# Altium project RNG_RPI.PrjPcb (part 3 of 3)

## Sheet GPS_SATA.SchDoc: RNG RPI Interface
size 420 x 297 mm; Author: G.Kasprowicz; CompanyName: WUT ISE; DrawnBy: G.Kasprowicz; Organization: WUT ISE; Address1: PW ISE; Address2: Nowowiejska 15/19 00-665 Warsaw; Address3: gkasprow@gmail.com; Revision: 2; SheetNumber: -; SheetTotal: -; ModifiedBy: -; CheckedDate: -; Title2: GPS & SATA IO; DivGrp: WUT ISE; Designer: G.Kasprowicz; ModifiedDate: -; ProjectName: Sensor Box
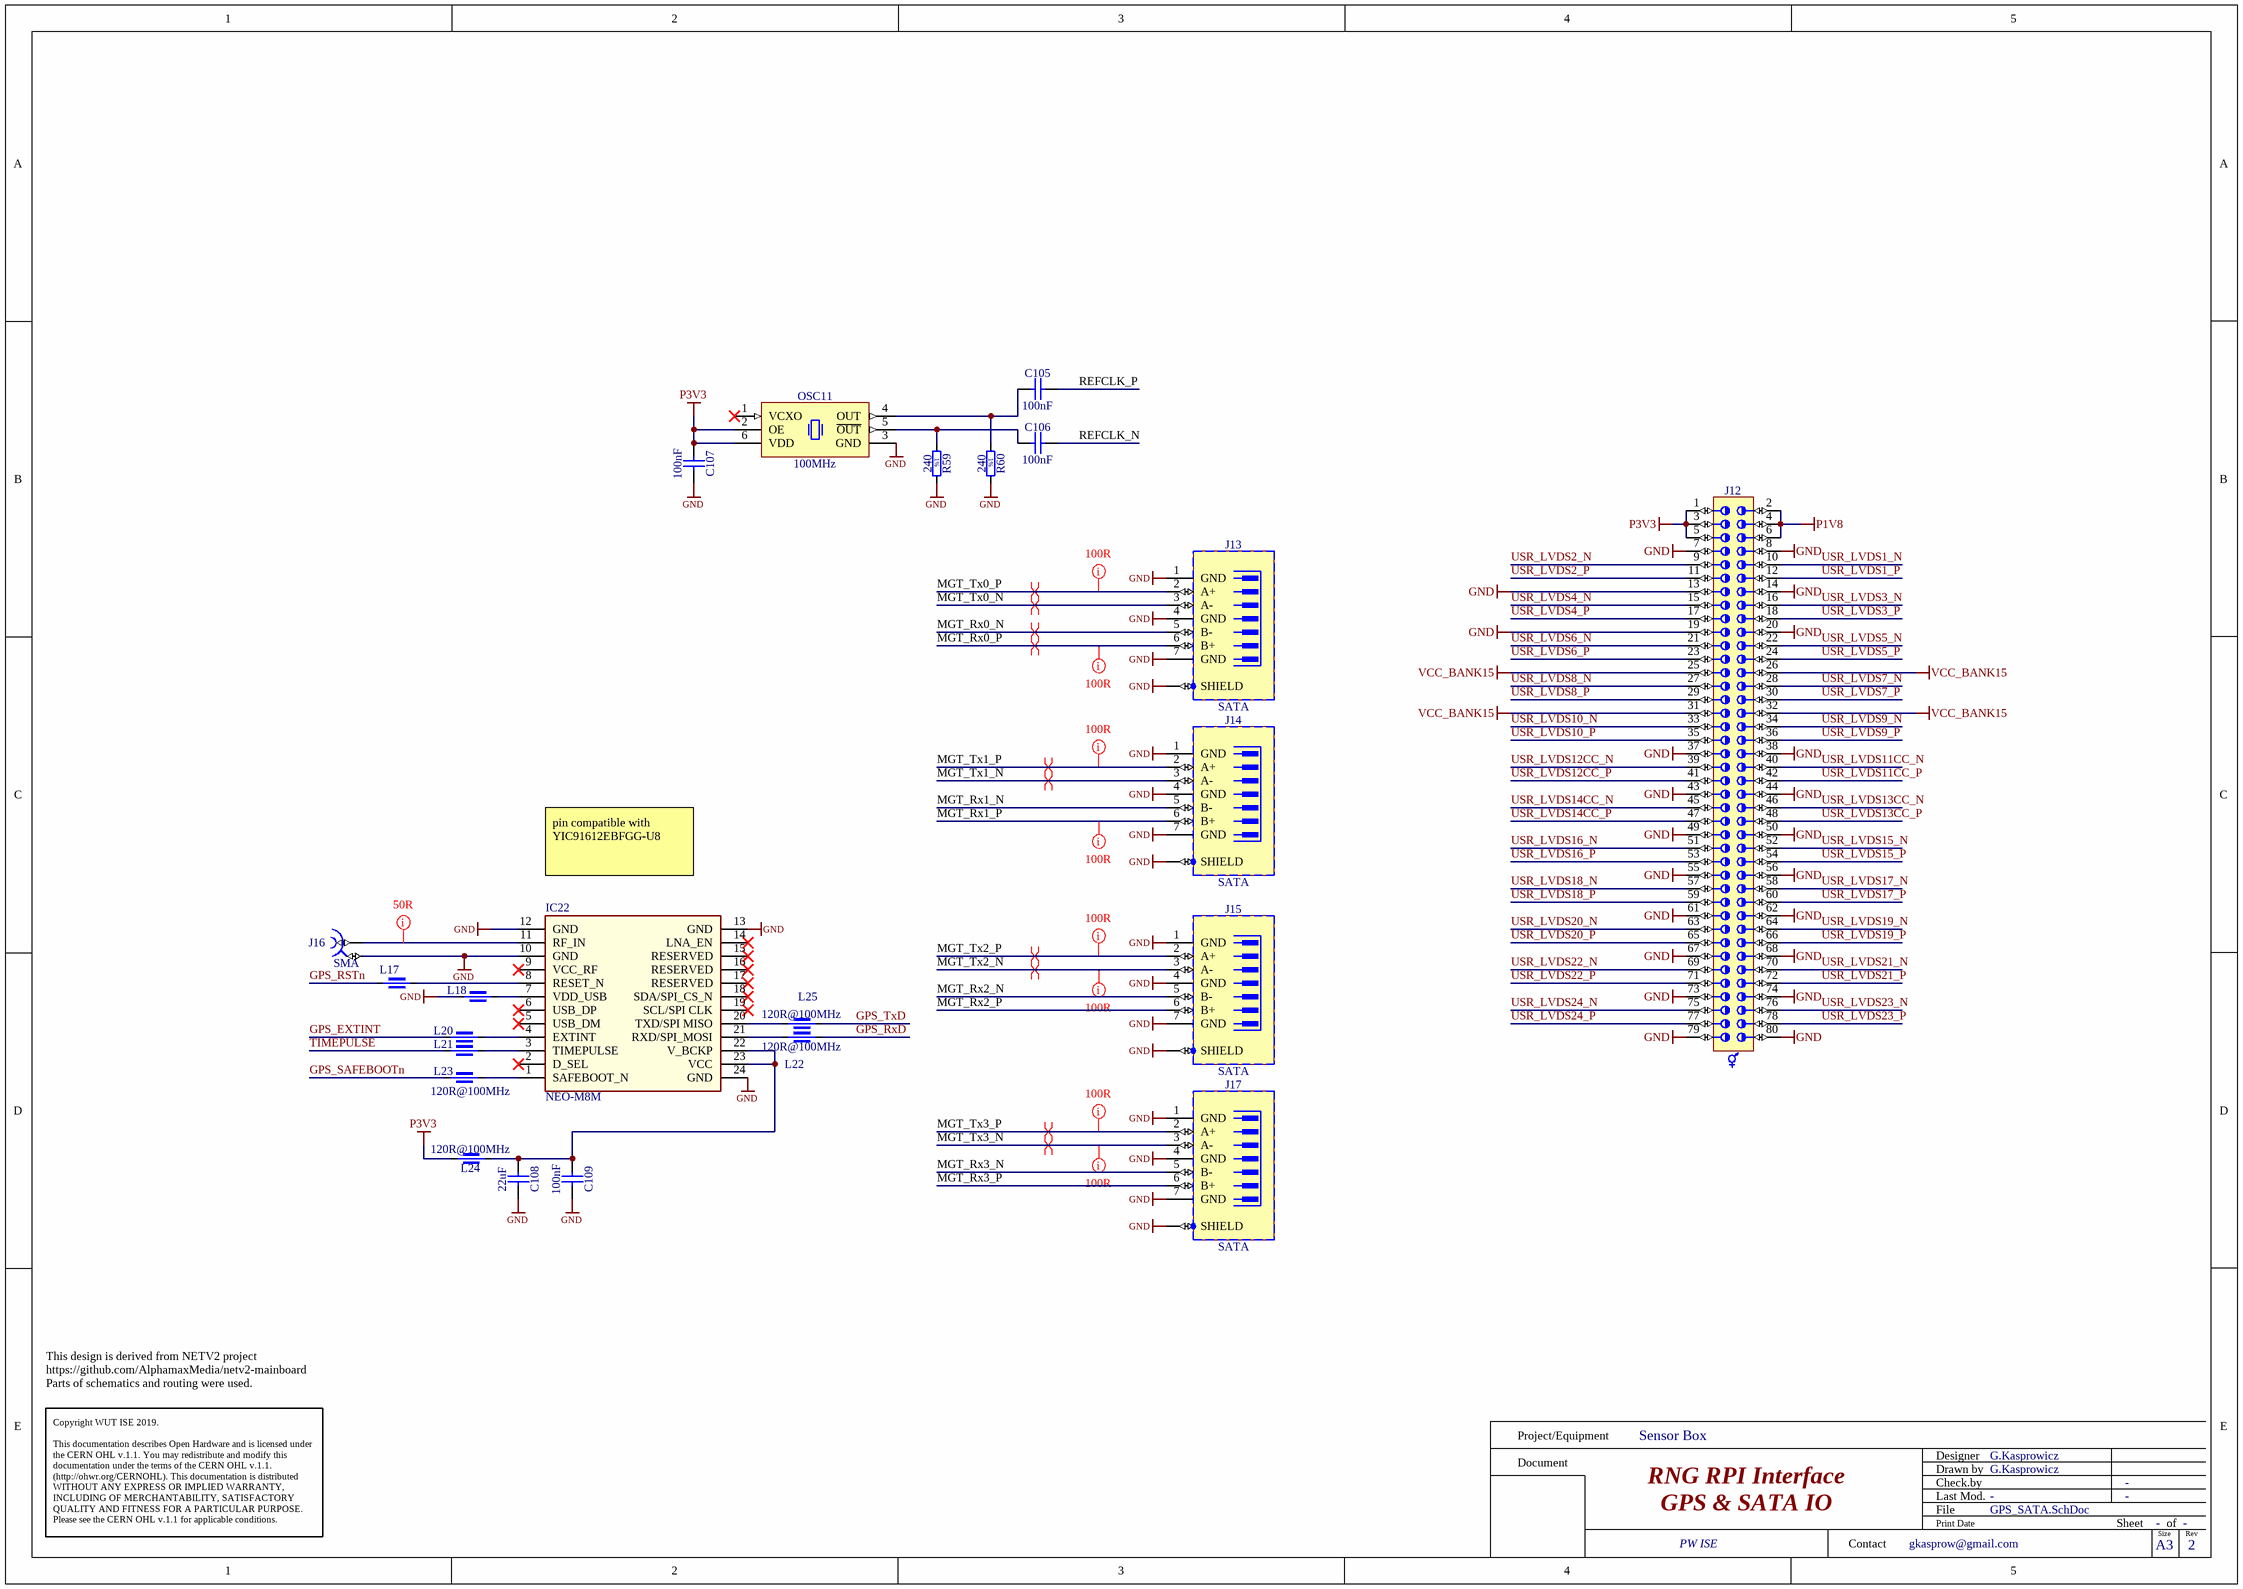
[diagram p4: GPS_SATA.SchDoc]

### Parts
C105  100nF  [CAPC0603X33N]
C106  100nF  [CAPC0603X33N]
C107  100nF  [CAPC0603X33N]
C108  22uF  [CAPC2012X135N]
C109  100nF  [CAPC0603X33N]
IC22  NEO-M8M  [NEO]
J12  (no value)  [SAMTEC_LSS-140-01-L-DV-A]
J13  SATA  [3M_5607-4200-SH]
J14  SATA  [3M_5607-4200-SH]
J15  SATA  [3M_5607-4200-SH]
J16  SMA  [MOLEX_73251-2120]
J17  SATA  [3M_5607-4200-SH]
L17  120R@100MHz  [INDC1608X65N]  (value not drawn)
L18  120R@100MHz  [INDC1608X65N]  (value not drawn)
L20  120R@100MHz  [INDC1608X65N]  (value not drawn)
L21  120R@100MHz  [INDC1608X65N]  (value not drawn)
L22  120R@100MHz  [INDC1608X65N]
L23  120R@100MHz  [INDC1608X65N]
L24  120R@100MHz  [INDC1608X65N]
L25  120R@100MHz  [INDC1608X65N]
OSC11  100MHz  [OSCSC254P500X700X190-6N]
R59  240  [RESC1005X40N]
R60  240  [RESC1005X40N]

### Nets
GND: C107.2 C108.2 C109.2 IC22.10(GND) IC22.12(GND) IC22.13(GND) IC22.24(GND) J12.7 J12.8 J12.13 J12.14 J12.19 J12.20 J12.37 J12.38 J12.43 J12.44 J12.49 J12.50 J12.55 J12.56 J12.61 J12.62 J12.67 J12.68 J12.73 J12.74 J12.79 J12.80 J13.1(GND) J13.4(GND) J13.7(GND) J13.8(SHIELD) J14.1(GND) J14.4(GND) J14.7(GND) J14.8(SHIELD) J15.1(GND) J15.4(GND) J15.7(GND) J15.8(SHIELD) J16.2 J17.1(GND) J17.4(GND) J17.7(GND) J17.8(SHIELD) L18.2 OSC11.3(GND) R59.2 R60.2
P1V8: J12.2 J12.4 J12.6
P3V3: C107.1 J12.1 J12.3 J12.5 L24.2 OSC11.2(OE) OSC11.6(VDD)
VCC_BANK15: J12.25 J12.26 J12.31 J12.32
GPS_EXTINT: L20.2
GPS_RSTn: L17.1
GPS_RxD: L22.2
GPS_SAFEBOOTn: L23.2
GPS_TxD: L25.1
MGT_Rx0_N: J13.5(B-)
MGT_Rx0_P: J13.6(B+)
MGT_Rx1_N: J14.5(B-)
MGT_Rx1_P: J14.6(B+)
MGT_Rx2_N: J15.5(B-)
MGT_Rx2_P: J15.6(B+)
MGT_Rx3_N: J17.5(B-)
MGT_Rx3_P: J17.6(B+)
MGT_Tx0_N: J13.3(A-)
MGT_Tx0_P: J13.2(A+)
MGT_Tx1_N: J14.3(A-)
MGT_Tx1_P: J14.2(A+)
MGT_Tx2_N: J15.3(A-)
MGT_Tx2_P: J15.2(A+)
MGT_Tx3_N: J17.3(A-)
MGT_Tx3_P: J17.2(A+)
REFCLK_N: C106.2
REFCLK_P: C105.2
TIMEPULSE: L21.2
USR_LVDS1_N: J12.10
USR_LVDS1_P: J12.12
USR_LVDS2_N: J12.9
USR_LVDS2_P: J12.11
USR_LVDS3_N: J12.16
USR_LVDS3_P: J12.18
USR_LVDS4_N: J12.15
USR_LVDS4_P: J12.17
USR_LVDS5_N: J12.22
USR_LVDS5_P: J12.24
USR_LVDS6_N: J12.21
USR_LVDS6_P: J12.23
USR_LVDS7_N: J12.28
USR_LVDS7_P: J12.30
USR_LVDS8_N: J12.27
USR_LVDS8_P: J12.29
USR_LVDS9_N: J12.34
USR_LVDS9_P: J12.36
USR_LVDS10_N: J12.33
USR_LVDS10_P: J12.35
USR_LVDS11CC_N: J12.40
USR_LVDS11CC_P: J12.42
USR_LVDS12CC_N: J12.39
USR_LVDS12CC_P: J12.41
USR_LVDS13CC_N: J12.46
USR_LVDS13CC_P: J12.48
USR_LVDS14CC_N: J12.45
USR_LVDS14CC_P: J12.47
USR_LVDS15_N: J12.52
USR_LVDS15_P: J12.54
USR_LVDS16_N: J12.51
USR_LVDS16_P: J12.53
USR_LVDS17_N: J12.58
USR_LVDS17_P: J12.60
USR_LVDS18_N: J12.57
USR_LVDS18_P: J12.59
USR_LVDS19_N: J12.64
USR_LVDS19_P: J12.66
USR_LVDS20_N: J12.63
USR_LVDS20_P: J12.65
USR_LVDS21_N: J12.70
USR_LVDS21_P: J12.72
USR_LVDS22_N: J12.69
USR_LVDS22_P: J12.71
USR_LVDS23_N: J12.76
USR_LVDS23_P: J12.78
USR_LVDS24_N: J12.75
USR_LVDS24_P: J12.77
NetC105_1: C105.1 OSC11.4(OUT) R60.1
NetC106_1: C106.1 OSC11.5(~{OUT}) R59.1
NetC108_1: C108.1 C109.1 IC22.22(V_BCKP) IC22.23(VCC) L24.1
NetIC22_1: IC22.1(SAFEBOOT_N) L23.1
NetIC22_3: IC22.3(TIMEPULSE) L21.1
NetIC22_4: IC22.4(EXTINT) L20.1
NetIC22_7: IC22.7(VDD_USB) L18.1
NetIC22_8: IC22.8(RESET_N) L17.2
NetIC22_11: IC22.11(RF_IN) J16.1
NetIC22_20: IC22.20(TXD/SPI_MISO) L25.2
NetIC22_21: IC22.21(RXD/SPI_MOSI) L22.1

Not connected (* = marked no-connect by the designer): IC22 2(D_SEL)* 5(USB_DM)* 6(USB_DP)* 9(VCC_RF)* 14(LNA_EN)* 15(RESERVED)* 16(RESERVED)* 17(RESERVED)* 18(SDA/SPI_CS_N)* 19(SCL/SPI_CLK)*; OSC11 1(VCXO)*

### Layout directives
differential pair: MGT_Rx0_N, MGT_Rx0_P, MGT_Tx0_N, MGT_Tx0_P, MGT_Tx1_N, MGT_Tx1_P, MGT_Tx2_N, MGT_Tx2_P, MGT_Tx3_N, MGT_Tx3_P
net class Z100R: MGT_Rx0_P, MGT_Rx1_P, MGT_Tx0_P, MGT_Tx1_P, MGT_Tx2_N, MGT_Tx2_P, MGT_Tx3_N, MGT_Tx3_P
net class Z50R: NetIC22_11

### Notes on the sheet
- pin compatible with YIC91612EBFGG-U8
- This design is derived from NETV2 project
  https://github.com/AlphamaxMedia/netv2-mainboard
  Parts of schematics and routing were used.
- Project/Equipment
- Document
- Designer
- Drawn by
- Check.by
- Copyright WUT ISE 2019.
  This documentation describes Open Hardware and is licensed under the CERN OHL v.1.1. You may redistribute and modify this documentation under the terms of the CERN OHL v.1.1. (http://ohwr.org/CERNOHL). This documentation is distributed WITHOUT ANY EXPRESS OR IMPLIED WARRANTY, INCLUDING OF MERCHANTABILITY, SATISFACTORY QUALITY AND FITNESS FOR A PARTICULAR PURPOSE. Please see the CERN OHL v.1.1 for applicable conditions.
- Contact
- File
- Last Mod.
- Print Date
- Sheet
- Size
- A3
- of
- Rev
- (in symbol R0402_240R_1%_0.0625W_100PPM) 1%

### Library data of the parts
C105-C107 C109 = CC0201_100NF_6.3V_10%_X5R: Non-polarised capacitor; Part Description: SMD Multilayer Chip Ceramic Capacitor; Manufacturer: GENERIC; Manufacturer1 Part Number: 02016D104KAT2A; Voltage: 6.3V; TC: X5R; Tolerance: ±10%; Part Number: CC0201_100NF_6.3V_10%_X5R; Component Kind: Standard; Component Type: Standard; Pin Count: 2; Value: 100nF; Status: Not Recommended; Manufacturer Part Number: CC0201_100NF_6.3V_10%_X5R; Case: 0201; Mounted: Yes; Socket: No; SMD: Yes; Sense: No; Manufacturer1 Example: AVX; Manufacturer1 ComponentHeight: 0.33mm; HelpURL: \\cern.ch\dfs\Applications\Altium\Datasheets\CC0201_X5R_AVX.pdf; Author: CERN DEM JLC; CreateDate: 03.12.2007; LatestRevisionDate: 03.12.2007
C108 = CC0805_22UF_16V_10%_X5R: Non-polarised capacitor; Part Description: SMD Multilayer Chip Ceramic Capacitor; Manufacturer: GENERIC; Manufacturer1 Part Number: C2012X5R1C226KT; Voltage: 16V; TC: X5R; Tolerance: ±10%; LatestRevisionDate: 25.10.2012; Value: 22uF; Part Number: CC0805_22UF_16V_10%_X5R; Component Kind: Standard; Component Type: Standard; Pin Count: 2; Status: Preferred; Manufacturer Part Number: CC0805_22UF_16V_10%_X5R; Case: 0805; Mounted: Yes; Socket: No; SMD: Yes; Sense: No; Manufacturer1 Example: TDK; Manufacturer1 ComponentHeight: 1.35mm; HelpURL: \\cern.ch\dfs\Applications\Altium\Datasheets\CC0805_X5R_TDK_C.pdf; Author: CERN DEM JLC; CreateDate: 25.10.2012
IC22 = NEO: u-blox NEO GNSS module; Part Description: u-blox GNSS module; Manufacturer: u-blox; Value: NEO-M8M
J12 = SAMTEC_LSS-140-01-L-DV-A: Connector 80 Hermaphroditic; Part Description: 80 Contacts, Pitch 0.635mm, Razor Beam LSS Vertical High Speed Hermaphroditic Strip (Lead Style 4.5mm); Manufacturer: SAMTEC; PressFit: No; Part Number: SAMTEC_LSS-140-01-L-DV-A; Component Kind: Standard; Component Type: Standard; Pin Count: 80; Mounted: Yes; Socket: No; Sense: No; SMD: Yes; Status: None; Manufacturer Part Number: LSS-140-01-L-DV-A; ComponentHeight: 4.57mm; HelpURL: \\cern.ch\dfs\Applications\Altium\Datasheets\SAMTEC_LSS-140-01-L-DV-A.pdf; Author: CERN DEM JMW; CreateDate: 10.11.2015; LatestRevisionDate: 10.11.2015
J13-J15 J17 = 3M_5607-4200-SH: 7 Pin + 1 Shield SATA Receptacle; Part Description: Signal Plug, Surfacemount, Right Angle,  Serial Advanced Technology Attachment (SATA) Connector, 5607 Series; Manufacturer: 3M; PressFit: No; Part Number: 3M_5607-4200-SH; Component Kind: Standard; Component Type: Standard; Pin Count: 8; Family: SATA; Mounted: Yes; Socket: No; SMD: Yes; Sense: No; Status: None; Manufacturer Part Number: 5607-4200-SH; ComponentHeight: 4mm; HelpURL: \\cern.ch\dfs\Applications\Altium\Datasheets\3M_5607-4200-SH.pdf; Author: CERN DEM JLC; CreateDate: 14.02.2011; LatestRevisionDate: 31.05.2011
J16 = CON_SMA_RA_SMD_73251-2120: 50 Ohm, SMA Edge Mount PCB, With Jam Nut And Lock Washer; Manufacturer: MOLEX; PressFit: No; Part Number: MOLEX_73251-2120; Component Kind: Standard; Component Type: Standard; Pin Count: 5; Family: SMA; Mounted: Yes; Socket: No; SMD: Yes; Sense: No; Status: None; Part Description: 50 Ohm, SMA Edge Mount PCB, With Jam Nut And Lock Washer; Manufacturer Part Number: 73251-2120; ComponentHeight: 5.75mm; HelpURL: \\cern.ch\dfs\Applications\Altium\Datasheets\MOLEX_73251-2121.pdf; Author: CERN DEM JLC; CreateDate: 26.10.2016; LatestRevisionDate: 26.10.2016
L17 L18 L20-L25 = IND0603_MURATA_BLM18SG121TN1D: Part Description: SMD EMIFIL Suppression Chip Ferrite Bead; Manufacturer: MURATA; Power: 3A; Resistance: 0.025R; Tolerance: ±25%; LatestRevisionDate: 25.10.2018; Value: 120R@100MHz; Part Number: IND0603_MURATA_BLM18SG121TN1D; Component Kind: Standard; Component Type: Standard; Pin Count: 2; Status: None; Manufacturer Part Number: BLM18SG121TN1D; Case: 0603; Mounted: Yes; Socket: No; SMD: Yes; Sense: No; ComponentHeight: 0.65mm; HelpURL: \\cern.ch\dfs\Applications\Altium\Datasheets\IND0603_MURATA_BLM18S.pdf; Author: CERN DEM JLC; CreateDate: 23.07.2014
OSC11 = OSC_100MHz_LVPECL: VCXO 100MHz Oscillator; Part Number: OSC_100MHZ_ABRACON_ASG-P-V-A-100.000MHZ; Part Description: Stability: ± 50ppm, -40°C to +85°C, Programmable - High Performance SMD XO, LVPECL Output, ASG-P Series; Manufacturer: ABRACON; Manufacturer Part Number: ASG-P-V-A-100.000MHZ; PressFit: No; Bonding: No; Component Kind: Standard; Component Type: Standard; PackageDescription: Oscillator, side concave; 2.54mm pitch; 6 pin, 5.00mm L X 7.00mm W X 1.90mm H, IPC Medium Density; Value: 100MHz; Pin Count: 6; Mounted: Yes; Socket: No; SMD: Yes; Sense: No; ComponentHeight: 1.9mm; HelpURL: \\cern.ch\dfs\Applications\Altium\Datasheets\OSC_ABRACON_ASG-D.pdf; Author: GK; CreateDate: 20.04.2016; LatestRevisionDate: 20.04.2016
R59 R60 = R0402_240R_1%_0.0625W_100PPM: Resistor - 1%; Part Description: General Purpose Thick Film Chip Resistor; Manufacturer: GENERIC; Manufacturer1 Part Number: 232270672401L; TC: ±100ppm/°C; PressFit: No; Part Number: R0402_240R_1%_0.0625W_100PPM; Component Kind: Standard; Component Type: Standard; Pin Count: 2; Value: 240; Status: Not Recommended; Power: 0.0625W; Tolerance: ±1%; Manufacturer Part Number: R0402_240R_1%_0.0625W_100PPM; Case: 0402; Mounted: Yes; Sense: No; Socket: No; SMD: Yes; Manufacturer1 Example: YAGEO PHYCOMP; Manufacturer1 ComponentHeight: 0.4mm; HelpURL: \\cern.ch\dfs\Applications\Altium\Datasheets\R0402_Phycomp_RC0402.pdf; Author: CERN DEM JLC; CreateDate: 03.12.2007; LatestRevisionDate: 17.10.2012

## Sheet Ethernet_SD.SchDoc: RNG RPI Interface
size 420 x 297 mm; Author: G.Kasprowicz; CompanyName: WUT ISE; DrawnBy: G.Kasprowicz; Organization: WUT ISE; Address1: PW ISE; Address2: Nowowiejska 15/19 00-665 Warsaw; Address3: gkasprow@gmail.com; Revision: 2; SheetNumber: -; SheetTotal: -; ModifiedBy: -; CheckedDate: -; Title2: Interfaces; DivGrp: WUT ISE; Designer: G.Kasprowicz; ModifiedDate: -; ProjectName: Sensor Box
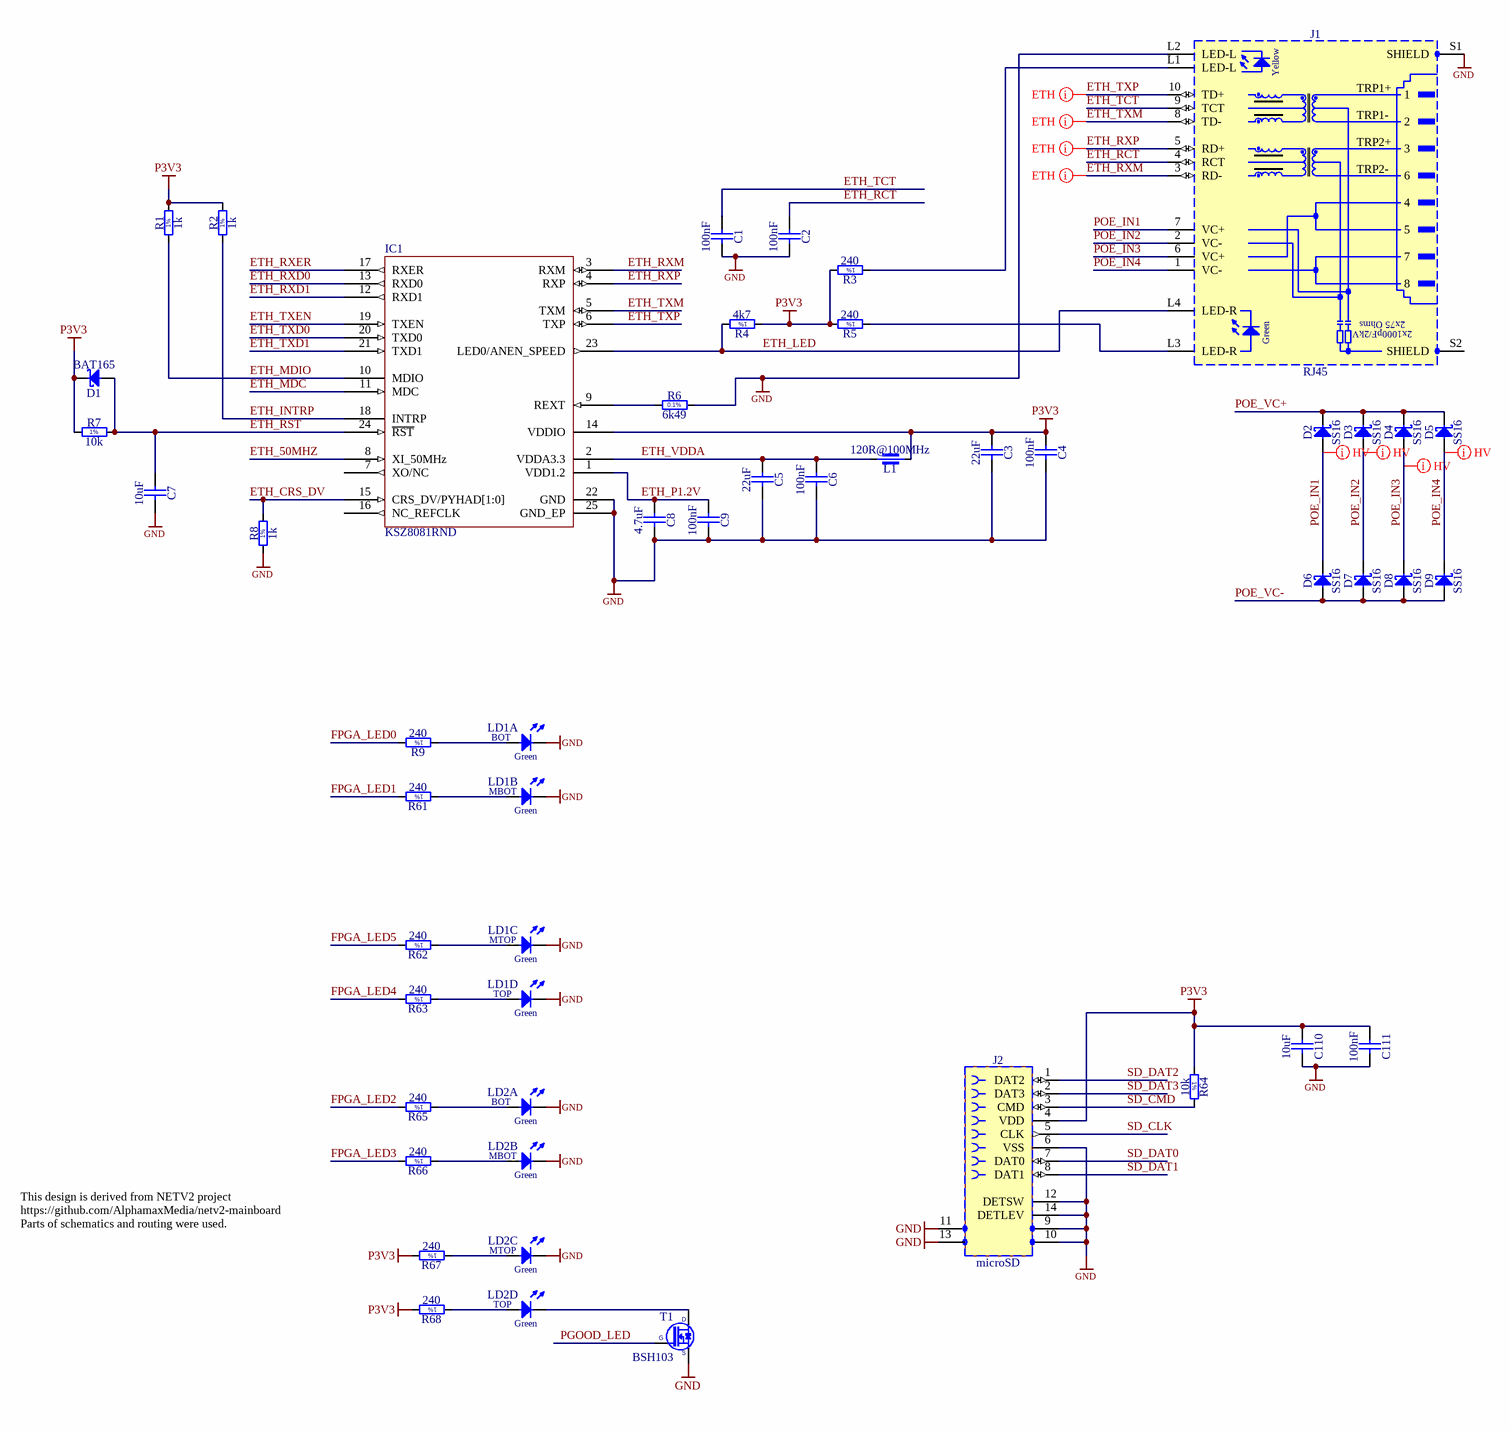
[diagram p5: Ethernet_SD.SchDoc]

### Parts
C1  100nF  [CAPC2012X135N]
C2  100nF  [CAPC2012X135N]
C3  22uF  [CAPC2012X135N]
C4  100nF  [CAPC0603X33N]
C5  22uF  [CAPC2012X135N]
C6  100nF  [CAPC0603X33N]
C7  10uF  [CAPC1608X80N]
C8  4.7uF  [CAPC1005X55N]
C9  100nF  [CAPC0603X33N]
C110  10uF  [CAPC1608X80N]
C111  100nF  [CAPC0603X33N]
D1  BAT165  [SOD2512X110N]
D2  SS16  [DIOM5127X229N]
D3  SS16  [DIOM5127X229N]
D4  SS16  [DIOM5127X229N]
D5  SS16  [DIOM5127X229N]
D6  SS16  [DIOM5127X229N]
D7  SS16  [DIOM5127X229N]
D8  SS16  [DIOM5127X229N]
D9  SS16  [DIOM5127X229N]
IC1  KSZ8081RND  [QFN50P400X400-24VBN]
J1  RJ45  [ABRACON_ARJM11C7-114-BA-EW2]
J2  microSD  [MOLEX_502570-0893]
L1  120R@100MHz  [INDC1608X65N]
LD1  Green  [LED_BIVAR_H485CGDL]  (value not drawn)  (parts A,B,C,D of 4)
LD2  Green  [LED_BIVAR_H485CGDL]  (value not drawn)  (parts A,B,C,D of 4)
R1  1k  [RESC1005X40N]
R2  1k  [RESC1005X40N]
R3  240  [RESC1005X40N]
R4  4k7  [RESC1005X40N]
R5  240  [RESC1005X40N]
R6  6k49  [RESC1005X35N]
R7  10k  [RESC1005X40N]
R8  1k  [RESC1005X40N]
R9  240  [RESC1005X40N]
R61  240  [RESC1005X40N]
R62  240  [RESC1005X40N]
R63  240  [RESC1005X40N]
R64  10k  [RESC1005X40N]
R65  240  [RESC1005X40N]
R66  240  [RESC1005X40N]
R67  240  [RESC1005X40N]
R68  240  [RESC1005X40N]
T1  BSH103  [SOT95P230X110-3N]

### Nets
GND: C1.2 C2.2 C3.2 C4.2 C5.2 C6.2 C7.2 C8.2 C9.2 C110.2 C111.2 IC1.22(GND) IC1.25(GND_EP) J1.L2(LED-L) J1.S1(SHIELD) J2.6(VSS) J2.9 J2.10 J2.11 J2.12(DETSW) J2.13 J2.14(DETLEV) LD1.1(C) LD1.3(C) LD1.5(C) LD1.7(C) LD2.1(C) LD2.3(C) LD2.5(C) R6.2 R8.1 T1.2(S)
P3V3: C3.1 C4.1 C110.1 C111.1 D1.1(C) IC1.14(VDDIO) J2.4(VDD) L1.1 R1.2 R2.2 R3.2 R4.1 R5.2 R7.1 R64.1 R67.2 R68.2
ETH_50MHZ: IC1.8(XI_50MHz)
ETH_CRS_DV: IC1.15(CRS_DV/PYHAD[1:0]) R8.2
ETH_INTRP: IC1.18(INTRP) R2.1
ETH_LED: IC1.23(LED0/ANEN_SPEED) J1.L4(LED-R) R4.2
ETH_MDC: IC1.11(MDC)
ETH_MDIO: IC1.10(MDIO) R1.1
ETH_P1.2V: C8.1 C9.1 IC1.1(VDD1.2)
ETH_RCT: C2.1 J1.4(RCT)
ETH_RST: C7.1 D1.2(A) IC1.24(~{RST}) R7.2
ETH_RXD0: IC1.13(RXD0)
ETH_RXD1: IC1.12(RXD1)
ETH_RXER: IC1.17(RXER)
ETH_RXM: IC1.3(RXM) J1.3(RD-)
ETH_RXP: IC1.4(RXP) J1.5(RD+)
ETH_TCT: C1.1 J1.9(TCT)
ETH_TXD0: IC1.20(TXD0)
ETH_TXD1: IC1.21(TXD1)
ETH_TXEN: IC1.19(TXEN)
ETH_TXM: IC1.5(TXM) J1.8(TD-)
ETH_TXP: IC1.6(TXP) J1.10(TD+)
ETH_VDDA: C5.1 C6.1 IC1.2(VDDA3.3) L1.2
FPGA_LED0: R9.2
FPGA_LED1: R61.2
FPGA_LED2: R65.2
FPGA_LED3: R66.2
FPGA_LED4: R63.2
FPGA_LED5: R62.2
PGOOD_LED: T1.1(G)
POE_IN1: D2.2(A) D6.1(C) J1.7(VC+)
POE_IN2: D3.2(A) D7.1(C) J1.2(VC-)
POE_IN3: D4.2(A) D8.1(C) J1.6(VC+)
POE_IN4: D5.2(A) D9.1(C) J1.1(VC-)
POE_VC+: D2.1(C) D3.1(C) D4.1(C) D5.1(C)
POE_VC-: D6.2(A) D7.2(A) D8.2(A) D9.2(A)
SD_CLK: J2.5(CLK)
SD_CMD: J2.3(CMD) R64.2
SD_DAT0: J2.7(DAT0)
SD_DAT1: J2.8(DAT1)
SD_DAT2: J2.1(DAT2)
SD_DAT3: J2.2(DAT3)
NetIC1_9: IC1.9(REXT) R6.1
NetJ1_L1: J1.L1(LED-L) R3.1
NetJ1_L3: J1.L3(LED-R) R5.1
NetLD1_2: LD1.2(A) R9.1
NetLD1_4: LD1.4(A) R61.1
NetLD1_6: LD1.6(A) R62.1
NetLD1_8: LD1.8(A) R63.1
NetLD2_2: LD2.2(A) R65.1
NetLD2_4: LD2.4(A) R66.1
NetLD2_6: LD2.6(A) R67.1
NetLD2_7: LD2.7(C) T1.3(D)
NetLD2_8: LD2.8(A) R68.1

Not connected (* = marked no-connect by the designer): IC1 7(XO/NC) 16(NC_REFCLK); J1 S2(SHIELD)

### Layout directives
net class ETH: ETH_RXM, ETH_RXP, ETH_TXM, ETH_TXP
net class HV: POE_IN1, POE_IN2, POE_IN3, POE_IN4

### Notes on the sheet
- This design is derived from NETV2 project
  https://github.com/AlphamaxMedia/netv2-mainboard
  Parts of schematics and routing were used.
- Project/Equipment
- Document
- Designer
- Drawn by
- Check.by
- Copyright WUT ISE 2019.
  This documentation describes Open Hardware and is licensed under the CERN OHL v.1.1. You may redistribute and modify this documentation under the terms of the CERN OHL v.1.1. (http://ohwr.org/CERNOHL). This documentation is distributed WITHOUT ANY EXPRESS OR IMPLIED WARRANTY, INCLUDING OF MERCHANTABILITY, SATISFACTORY QUALITY AND FITNESS FOR A PARTICULAR PURPOSE. Please see the CERN OHL v.1.1 for applicable conditions.
- Contact
- File
- Last Mod.
- Print Date
- Sheet
- Size
- A3
- of
- Rev
- (in symbol CON_ETH_POE_ARJM11C7) Yellow; TRP1+; TRP1-; TRP2+; TRP2-; 2x75 Ohms; Green; 2x1000pF/2kV
- (in symbol LED_BIVAR_H485CGDL, part A) BOT
- (in symbol LED_BIVAR_H485CGDL, part B) MBOT
- (in symbol LED_BIVAR_H485CGDL, part C) MTOP
- (in symbol LED_BIVAR_H485CGDL, part D) TOP
- (in symbol R0402_1K_1%_0.0625W_100PPM) 1%
- (in symbol R0402_4K7_1%_0.0625W_100PPM) 1%
- (in symbol R0402_6K49_0.1%_0.063W_25PPM) 0.1%
- (in symbol R0402_10K_1%_0.0625W_100PPM) 1%
- (in symbol R0402_240R_1%_0.0625W_100PPM) 1%

### Library data of the parts
C1 C2 = CC0805_100NF_50V_10%_X7R: Non-polarised capacitor; Part Description: SMD Multilayer Chip Ceramic Capacitor; Manufacturer: GENERIC; Manufacturer1 Part Number: C2012X7R1H104K085AA; Voltage: 50V; TC: X7R; Tolerance: ±10%; Part Number: CC0805_100NF_50V_10%_X7R; Component Kind: Standard; Component Type: Standard; Pin Count: 2; Value: 100nF; Status: Preferred; Manufacturer Part Number: CC0805_100NF_50V_10%_X7R; Case: 0805; Mounted: Yes; Socket: No; SMD: Yes; Sense: No; Manufacturer1 Example: TDK; Manufacturer1 ComponentHeight: 1mm; HelpURL: \\cern.ch\dfs\Applications\Altium\Datasheets\CC0805_X7R_TDK_C.pdf; Author: CERN DEM JLC; CreateDate: 03.12.2007; LatestRevisionDate: 22.04.2015
C3 C5 = CC0805_22UF_16V_10%_X5R: as C108 on sheet GPS_SATA; LatestRevisionDate: 25.10.2012; Value: 22uF; Part Number: CC0805_22UF_16V_10%_X5R; Component Kind: Standard; Component Type: Standard; Pin Count: 2; Status: Preferred; Manufacturer Part Number: CC0805_22UF_16V_10%_X5R; Case: 0805; Mounted: Yes; Socket: No; SMD: Yes; Sense: No; Manufacturer1 Example: TDK; Manufacturer1 ComponentHeight: 1.35mm; HelpURL: \\cern.ch\dfs\Applications\Altium\Datasheets\CC0805_X5R_TDK_C.pdf; Author: CERN DEM JLC; CreateDate: 25.10.2012
C4 C6 C9 C111 = CC0201_100NF_6.3V_10%_X5R: as C105-C107 on sheet GPS_SATA; Part Number: CC0201_100NF_6.3V_10%_X5R; Component Kind: Standard; Component Type: Standard; Pin Count: 2; Value: 100nF; Status: Not Recommended; Manufacturer Part Number: CC0201_100NF_6.3V_10%_X5R; Case: 0201; Mounted: Yes; Socket: No; SMD: Yes; Sense: No; Manufacturer1 Example: AVX; Manufacturer1 ComponentHeight: 0.33mm; HelpURL: \\cern.ch\dfs\Applications\Altium\Datasheets\CC0201_X5R_AVX.pdf; Author: CERN DEM JLC; CreateDate: 03.12.2007; LatestRevisionDate: 03.12.2007
C7 C110 = CC0603_10UF_10V_10%_X5R: Non-polarised capacitor; Part Description: SMD Multilayer Chip Ceramic Capacitor; Manufacturer: GENERIC; Manufacturer1 Part Number: GRM188R61A106KE69D; Voltage: 10V; TC: X5R; Tolerance: ±10%; Part Number: CC0603_10UF_10V_10%_X5R; Component Kind: Standard; Component Type: Standard; Pin Count: 2; Value: 10uF; Status: None; Manufacturer Part Number: CC0603_10UF_10V_10%_X5R; Case: 0603; Mounted: Yes; Socket: No; SMD: Yes; Sense: No; Manufacturer1 Example: MURATA; Manufacturer1 ComponentHeight: 0.8mm; HelpURL: \\cern.ch\dfs\Applications\Altium\Datasheets\CC0603_MURATA_GRM188R61A106KE69D.pdf; Author: CERN DEM JLC; CreateDate: 31.01.2017; LatestRevisionDate: 31.01.2017
C8 = CC0402_4.7UF_6.3V_20%_X5R: Non-polarised capacitor; Part Description: SMD Multilayer Chip Ceramic Capacitor; Manufacturer: GENERIC; Manufacturer1 Part Number: C1005X5R0J475M050BC; Voltage: 6.3V; TC: X5R; Tolerance: ±20%; Part Number: CC0402_4.7UF_6.3V_20%_X5R; Component Kind: Standard; Component Type: Standard; Pin Count: 2; Value: 4.7uF; Status: Preferred; Manufacturer Part Number: CC0402_4.7UF_6.3V_20%_X5R; Case: 0402; Mounted: Yes; Socket: No; SMD: Yes; Sense: No; Manufacturer1 Example: TDK; Manufacturer1 ComponentHeight: 0.65mm; HelpURL: \\cern.ch\dfs\Applications\Altium\Datasheets\CC0402_X5R_TDK_C.pdf; Author: CERN DEM JLC; CreateDate: 03.03.2015; LatestRevisionDate: 03.03.2015
D1 = BAT165: Schottky Diode; Part Description: Medium Power AF Schottky Diode; Manufacturer: INFINEON; Voltage: 40V; Power: 750mA; PressFit: No; Bonding: No; Part Number: BAT165; Component Kind: Standard; Component Type: Standard; Device: BAT165; PackageDescription: Small Outline Diode (SOD-323), 1.70mm W X 1.25mm L X 1.10mm H body,  IPC Medium Density; Manufacturer Part Number: BAT165; Pin Count: 2; Case: SOD323; Mounted: Yes; Socket: No; SMD: Yes; Sense: No; ComponentHeight: 1.1mm; HelpURL: \\cern.ch\dfs\Applications\Altium\Datasheets\BAT165.pdf; Author: CERN DEM JLC; CreateDate: 12.11.2014; LatestRevisionDate: 12.11.2014
D2-D9 = SS16: Schottky Diode; Part Description: Surface Mount Schottky Barrier Rectifier; Manufacturer: VISHAY GENERAL SEMICONDUCTOR; Voltage: 60V; Power: 1A; PressFit: No; Bonding: No; Part Number: SS16; Component Kind: Standard; Component Type: Standard; Device: SS16; PackageDescription: DO-214-AC Molded Diode, Body 5.1x2.7mm, IPC Medium Density; Manufacturer Part Number: SS16; Pin Count: 2; Case: DO-214AC; Mounted: Yes; Socket: No; SMD: Yes; Sense: No; ComponentHeight: 2.29mm; HelpURL: \\cern.ch\dfs\Applications\Altium\Datasheets\SS16.pdf; Author: CERN DEM JLC; CreateDate: 15.07.2008; LatestRevisionDate: 23.08.2010
IC1 = KSZ8081RND: KSZ8081RND MII Ethernet PHY; MPN: KSZ8081RNDCA; MYPN: UKSZ8081RND; VENDOR: Microchip
J1 = CON_ETH_POE_ARJM11C7: MagJack 10/100BaseT, PoE+, 1X1, OG/Y, -40 to 85*C, Tab Up, RoHS; Part Number: ARJM11C7-114-BA-EW2; Part Description: 1 Port, Orange Green/Yellow LEDs, RJ45 10/100BaseT, PoE, Ethernet MagJack® Connector Module; Manufacturer: Abracon; PressFit: No; Component Kind: Standard; Component Type: Standard; Pin Count: 18; Family: RJ45; Mounted: Yes; Socket: No; SMD: No; Sense: No; Status: None; Manufacturer Part Number: ARJM11C7-114-BA-EW2; ComponentHeight: 13.61mm; HelpURL: \\cern.ch\dfs\Applications\Altium\Datasheets\BELFUSE_0826-1X1T-GJ-F.pdf; Author: GK; CreateDate: 05.11.2012; LatestRevisionDate: 05.11.2012
J2 = MOLEX_502570-0893: Connector MicroSD 8 Pin; Part Description: 1.10mm Pitch, Surface Mount, Normal Mount MicroSD Memory Card Connector; Manufacturer: MOLEX; PressFit: No; Part Number: MOLEX_502570-0893; Component Kind: Standard; Component Type: Standard; Pin Count: 12; Family: microSD; Mounted: Yes; Socket: No; SMD: Yes; Sense: No; Status: None; Manufacturer Part Number: 502570-0893; ComponentHeight: 2.03mm; HelpURL: \\cern.ch\dfs\Applications\Altium\Datasheets\MOLEX_502570-0893.pdf; Author: CERN DEM JLC; CreateDate: 22.01.2015; LatestRevisionDate: 22.01.2015
L1 = IND0603_MURATA_BLM18SG121TN1D: as L17 on sheet GPS_SATA; LatestRevisionDate: 25.10.2018; Value: 120R@100MHz; Part Number: IND0603_MURATA_BLM18SG121TN1D; Component Kind: Standard; Component Type: Standard; Pin Count: 2; Status: None; Manufacturer Part Number: BLM18SG121TN1D; Case: 0603; Mounted: Yes; Socket: No; SMD: Yes; Sense: No; ComponentHeight: 0.65mm; HelpURL: \\cern.ch\dfs\Applications\Altium\Datasheets\IND0603_MURATA_BLM18S.pdf; Author: CERN DEM JLC; CreateDate: 23.07.2014
LD1 LD2 = LED_BIVAR_H485CGDL: LED x4 Green 1C2A-BOT_3C4A_5C6A_7C8A-TOP; Part Description: Quad-Level 2mm Green LED, PCB Edge Mounting; Manufacturer: BIVAR; PressFit: No; Bonding: No; Part Number: LED_BIVAR_H485CGDL; Component Kind: Standard; Component Type: Standard; Color: Green; PackageDescription: Quad-Level 2mm Green, PCB Edge Mounting  BIVAR H485CHDL; Manufacturer Part Number: H485CGDL; Pin Count: 8; Mounted: Yes; Socket: No; SMD: No; Sense: No; ComponentHeight: 11.3mm; HelpURL: \\cern.ch\dfs\Applications\Altium\Datasheets\LED_BIVAR_H485CGDL.pdf; Author: CERN DEM JLC; CreateDate: 04.06.2012; LatestRevisionDate: 04.06.2012
R1 R2 R8 = R0402_1K_1%_0.0625W_100PPM: Resistor - 1%; Part Description: General Purpose Thick Film Chip Resistor; Manufacturer: GENERIC; Manufacturer1 Part Number: 232270671002L; TC: ±100ppm/°C; PressFit: No; Part Number: R0402_1K_1%_0.0625W_100PPM; Component Kind: Standard; Component Type: Standard; Pin Count: 2; Value: 1k; Status: Not Recommended; Power: 0.0625W; Tolerance: ±1%; Manufacturer Part Number: R0402_1K_1%_0.0625W_100PPM; Case: 0402; Mounted: Yes; Sense: No; Socket: No; SMD: Yes; Manufacturer1 Example: YAGEO PHYCOMP; Manufacturer1 ComponentHeight: 0.4mm; HelpURL: \\cern.ch\dfs\Applications\Altium\Datasheets\R0402_Phycomp_RC0402.pdf; Author: CERN DEM JLC; CreateDate: 03.12.2007; LatestRevisionDate: 17.10.2012
R3 R5 R9 R61-R63 R65-R68 = R0402_240R_1%_0.0625W_100PPM: as R59 on sheet GPS_SATA; Part Number: R0402_240R_1%_0.0625W_100PPM; Component Kind: Standard; Component Type: Standard; Pin Count: 2; Value: 240; Status: Not Recommended; Power: 0.0625W; Tolerance: ±1%; Manufacturer Part Number: R0402_240R_1%_0.0625W_100PPM; Case: 0402; Mounted: Yes; Sense: No; Socket: No; SMD: Yes; Manufacturer1 Example: YAGEO PHYCOMP; Manufacturer1 ComponentHeight: 0.4mm; HelpURL: \\cern.ch\dfs\Applications\Altium\Datasheets\R0402_Phycomp_RC0402.pdf; Author: CERN DEM JLC; CreateDate: 03.12.2007; LatestRevisionDate: 17.10.2012
R4 = R0402_4K7_1%_0.0625W_100PPM: Resistor - 1%; Part Description: General Purpose Thick Film Chip Resistor; Manufacturer: GENERIC; Manufacturer1 Part Number: 232270674702L; TC: ±100ppm/°C; PressFit: No; Part Number: R0402_4K7_1%_0.0625W_100PPM; Component Kind: Standard; Component Type: Standard; Pin Count: 2; Value: 4k7; Status: Not Recommended; Power: 0.0625W; Tolerance: ±1%; Manufacturer Part Number: R0402_4K7_1%_0.0625W_100PPM; Case: 0402; Mounted: Yes; Sense: No; Socket: No; SMD: Yes; Manufacturer1 Example: YAGEO PHYCOMP; Manufacturer1 ComponentHeight: 0.4mm; HelpURL: \\cern.ch\dfs\Applications\Altium\Datasheets\R0402_Phycomp_RC0402.pdf; Author: CERN DEM JLC; CreateDate: 03.12.2007; LatestRevisionDate: 17.10.2012
R6 = R0402_6K49_0.1%_0.063W_25PPM: Resistor - 0.1%; Part Description: Thin Film Precision Resistor; Manufacturer: GENERIC; Manufacturer1 Part Number: CPF0402B6K49E1; Power: 0.063W; TC: ±25ppm/°C; PressFit: No; Part Number: R0402_6K49_0.1%_0.063W_25PPM; Component Kind: Standard; Component Type: Standard; Pin Count: 2; Value: 6k49; Status: Not Recommended; Tolerance: ±0.1%; Manufacturer Part Number: R0402_6K49_0.1%_0.063W_25PPM; Case: 0402; Mounted: Yes; Sense: No; Socket: No; SMD: Yes; Manufacturer1 Example: TE CONNECTIVITY; Manufacturer1 ComponentHeight: 0.35mm; HelpURL: \\cern.ch\dfs\Applications\Altium\Datasheets\R0402_TYCO_CPF.pdf; Author: CERN DEM JMW; CreateDate: 22.09.2015; LatestRevisionDate: 22.09.2015
R7 R64 = R0402_10K_1%_0.0625W_100PPM: Resistor - 1%; Part Description: General Purpose Thick Film Chip Resistor; Manufacturer: GENERIC; Manufacturer1 Part Number: 232270671003L; TC: ±100ppm/°C; PressFit: No; Part Number: R0402_10K_1%_0.0625W_100PPM; Component Kind: Standard; Component Type: Standard; Pin Count: 2; Value: 10k; Status: Not Recommended; Power: 0.0625W; Tolerance: ±1%; Manufacturer Part Number: R0402_10K_1%_0.0625W_100PPM; Case: 0402; Mounted: Yes; Sense: No; Socket: No; SMD: Yes; Manufacturer1 Example: YAGEO PHYCOMP; Manufacturer1 ComponentHeight: 0.4mm; HelpURL: \\cern.ch\dfs\Applications\Altium\Datasheets\R0402_Phycomp_RC0402.pdf; Author: CERN DEM JLC; CreateDate: 03.12.2007; LatestRevisionDate: 17.10.2012
T1 = BSH103: N-CHANNEL MOSFET WITH DIODE; Part Description: 30V 850mA N-Channel Enhancement Mode Field-Effect Transistor; Manufacturer: NEXPERIA; PressFit: No; Bonding: No; Part Number: BSH103; Component Kind: Standard; Component Type: Standard; Device: BSH103; PackageDescription: SOT23, 3 pin, Pitch 0.95mm - 1.3mm W X 2.9mm L X 1.1mm H, IPC Medium Density; Manufacturer Part Number: BSH103; Pin Count: 3; Case: SOT23-3; Mounted: Yes; Socket: No; SMD: Yes; Sense: No; ComponentHeight: 1.1mm; HelpURL: \\cern.ch\dfs\Applications\Altium\Datasheets\BSH103.pdf; Author: CERN DEM JLC; CreateDate: 16.03.2010; LatestRevisionDate: 20.06.2017; ClassName: Artix

## Sheet FPGA_Supply.SchDoc: RNG RPI Interface
size 420 x 297 mm; Author: G.Kasprowicz; CompanyName: WUT ISE; DrawnBy: G.Kasprowicz; Organization: WUT ISE; Address1: PW ISE; Address2: Nowowiejska 15/19 00-665 Warsaw; Address3: gkasprow@gmail.com; Revision: 2; SheetNumber: -; SheetTotal: -; ModifiedBy: -; CheckedDate: -; Title2: FPGA supply; DivGrp: WUT ISE; Designer: G.Kasprowicz; ModifiedDate: -; ProjectName: Sensor Box
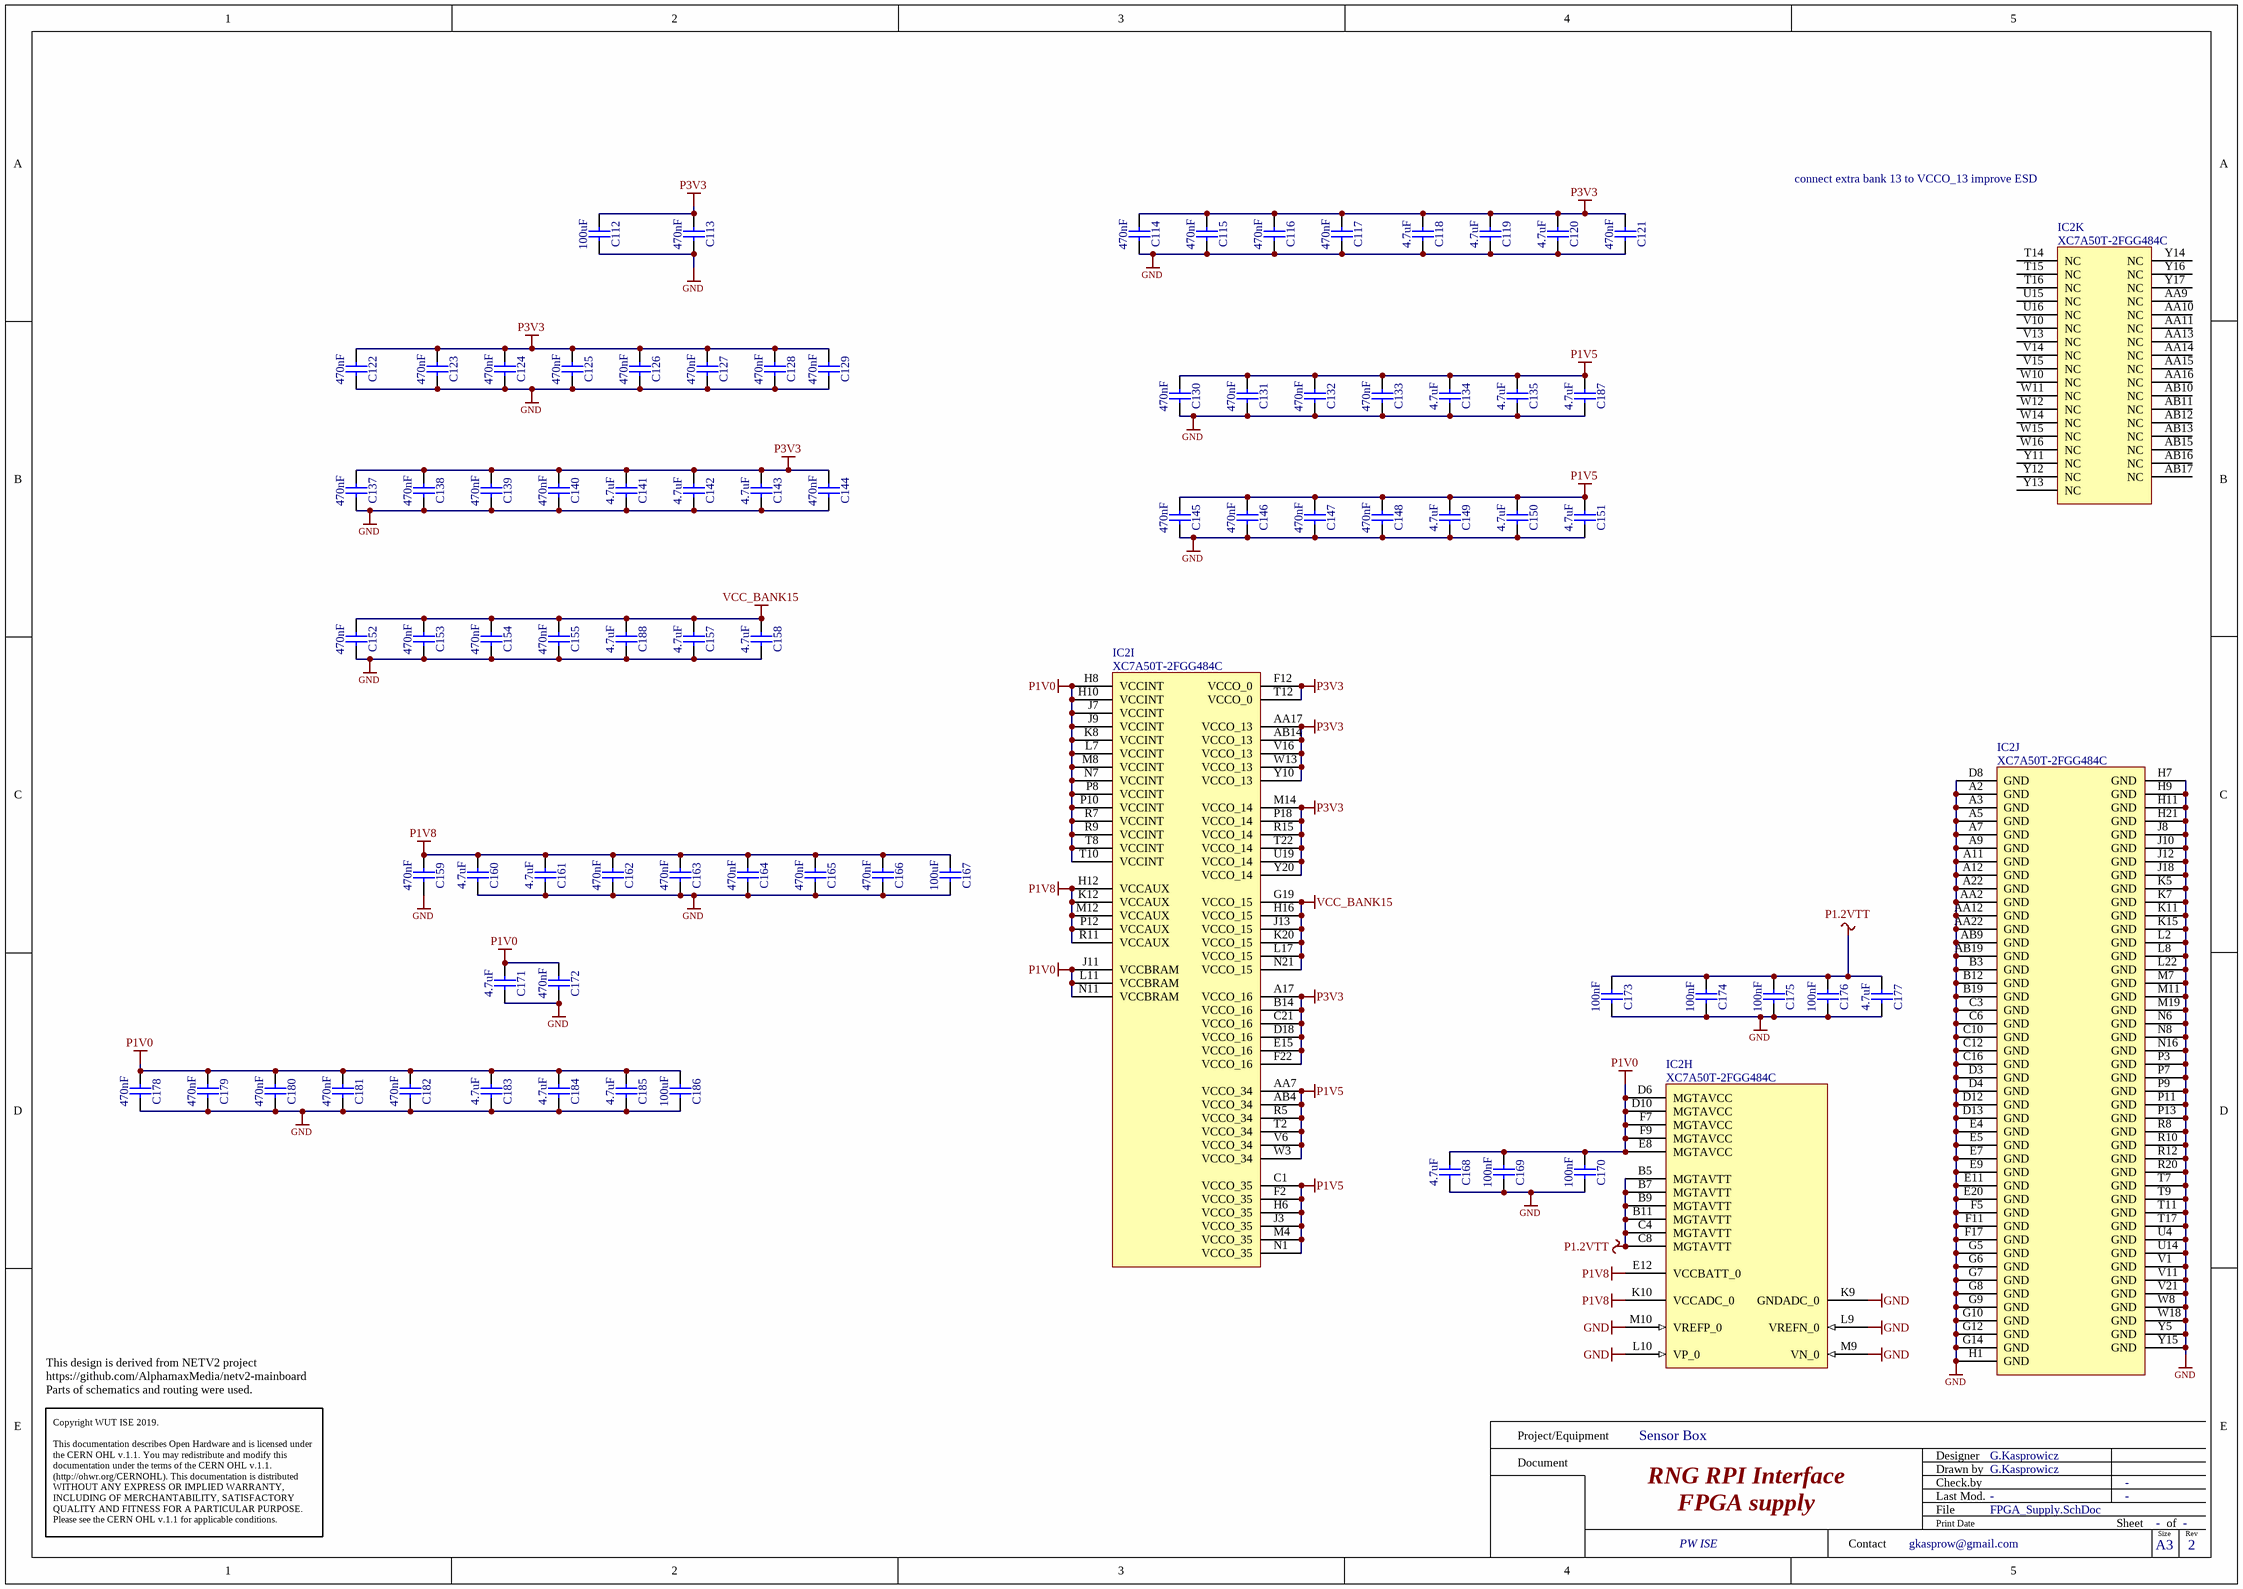
[diagram p6: FPGA_Supply.SchDoc]

### Parts
C112  100uF  [CAPC3216X180N]
C113  470nF  [CAPC0603X33N]
C114  470nF  [CAPC0603X33N]
C115  470nF  [CAPC0603X33N]
C116  470nF  [CAPC0603X33N]
C117  470nF  [CAPC0603X33N]
C118  4.7uF  [CAPC1005X55N]
C119  4.7uF  [CAPC1005X55N]
C120  4.7uF  [CAPC1005X55N]
C121  470nF  [CAPC0603X33N]
C122  470nF  [CAPC0603X33N]
C123  470nF  [CAPC0603X33N]
C124  470nF  [CAPC0603X33N]
C125  470nF  [CAPC0603X33N]
C126  470nF  [CAPC0603X33N]
C127  470nF  [CAPC0603X33N]
C128  470nF  [CAPC0603X33N]
C129  470nF  [CAPC0603X33N]
C130  470nF  [CAPC0603X33N]
C131  470nF  [CAPC0603X33N]
C132  470nF  [CAPC0603X33N]
C133  470nF  [CAPC0603X33N]
C134  4.7uF  [CAPC1005X55N]
C135  4.7uF  [CAPC1005X55N]
C137  470nF  [CAPC0603X33N]
C138  470nF  [CAPC0603X33N]
C139  470nF  [CAPC0603X33N]
C140  470nF  [CAPC0603X33N]
C141  4.7uF  [CAPC1005X55N]
C142  4.7uF  [CAPC1005X55N]
C143  4.7uF  [CAPC1005X55N]
C144  470nF  [CAPC0603X33N]
C145  470nF  [CAPC0603X33N]
C146  470nF  [CAPC0603X33N]
C147  470nF  [CAPC0603X33N]
C148  470nF  [CAPC0603X33N]
C149  4.7uF  [CAPC1005X55N]
C150  4.7uF  [CAPC1005X55N]
C151  4.7uF  [CAPC1005X55N]
C152  470nF  [CAPC0603X33N]
C153  470nF  [CAPC0603X33N]
C154  470nF  [CAPC0603X33N]
C155  470nF  [CAPC0603X33N]
C157  4.7uF  [CAPC1005X55N]
C158  4.7uF  [CAPC1005X55N]
C159  470nF  [CAPC0603X33N]
C160  4.7uF  [CAPC1005X55N]
C161  4.7uF  [CAPC1005X55N]
C162  470nF  [CAPC0603X33N]
C163  470nF  [CAPC0603X33N]
C164  470nF  [CAPC0603X33N]
C165  470nF  [CAPC0603X33N]
C166  470nF  [CAPC0603X33N]
C167  100uF  [CAPC3216X180N]
C168  4.7uF  [CAPC1005X55N]
C169  100nF  [CAPC0603X33N]
C170  100nF  [CAPC0603X33N]
C171  4.7uF  [CAPC1005X55N]
C172  470nF  [CAPC0603X33N]
C173  100nF  [CAPC0603X33N]
C174  100nF  [CAPC0603X33N]
C175  100nF  [CAPC0603X33N]
C176  100nF  [CAPC0603X33N]
C177  4.7uF  [CAPC1005X55N]
C178  470nF  [CAPC0603X33N]
C179  470nF  [CAPC0603X33N]
C180  470nF  [CAPC0603X33N]
C181  470nF  [CAPC0603X33N]
C182  470nF  [CAPC0603X33N]
C183  4.7uF  [CAPC1005X55N]
C184  4.7uF  [CAPC1005X55N]
C185  4.7uF  [CAPC1005X55N]
C186  100uF  [CAPC3216X180N]
C187  4.7uF  [CAPC1005X55N]
C188  4.7uF  [CAPC1005X55N]
IC2  XC7A50T-2FGG484C  [BGA484C100P22X22_2300X2300X260]  (parts H,I,J,K of 11)

### Nets
GND: C112.2 C113.2 C114.2 C115.2 C116.2 C117.2 C118.2 C119.2 C120.2 C121.2 C122.2 C123.2 C124.2 C125.2 C126.2 C127.2 C128.2 C129.2 C130.2 C131.2 C132.2 C133.2 C134.2 C135.2 C137.2 C138.2 C139.2 C140.2 C141.2 C142.2 C143.2 C144.2 C145.2 C146.2 C147.2 C148.2 C149.2 C150.2 C151.2 C152.2 C153.2 C154.2 C155.2 C157.2 C158.2 C159.2 C160.2 C161.2 C162.2 C163.2 C164.2 C165.2 C166.2 C167.2 C168.2 C169.2 C170.2 C171.2 C172.2 C173.2 C174.2 C175.2 C176.2 C177.2 C178.2 C179.2 C180.2 C181.2 C182.2 C183.2 C184.2 C185.2 C186.2 C187.2 C188.2 IC2.A2(GND) IC2.A3(GND) IC2.A5(GND) IC2.A7(GND) IC2.A9(GND) IC2.A11(GND) IC2.A12(GND) IC2.A22(GND) IC2.AA2(GND) IC2.AA12(GND) IC2.AA22(GND) IC2.AB9(GND) IC2.AB19(GND) IC2.B3(GND) IC2.B12(GND) IC2.B19(GND) IC2.C3(GND) IC2.C6(GND) IC2.C10(GND) IC2.C12(GND) IC2.C16(GND) IC2.D3(GND) IC2.D4(GND) IC2.D8(GND) IC2.D12(GND) IC2.D13(GND) IC2.E4(GND) IC2.E5(GND) IC2.E7(GND) IC2.E9(GND) IC2.E11(GND) IC2.E20(GND) IC2.F5(GND) IC2.F11(GND) IC2.F17(GND) IC2.G5(GND) IC2.G6(GND) IC2.G7(GND) IC2.G8(GND) IC2.G9(GND) IC2.G10(GND) IC2.G12(GND) IC2.G14(GND) IC2.H1(GND) IC2.H7(GND) IC2.H9(GND) IC2.H11(GND) IC2.H21(GND) IC2.J8(GND) IC2.J10(GND) IC2.J12(GND) IC2.J18(GND) IC2.K5(GND) IC2.K7(GND) IC2.K9(GNDADC_0) IC2.K11(GND) IC2.K15(GND) IC2.L2(GND) IC2.L8(GND) IC2.L9(VREFN_0) IC2.L10(VP_0) IC2.L22(GND) IC2.M7(GND) IC2.M9(VN_0) IC2.M10(VREFP_0) IC2.M11(GND) IC2.M19(GND) IC2.N6(GND) IC2.N8(GND) IC2.N16(GND) IC2.P3(GND) IC2.P7(GND) IC2.P9(GND) IC2.P11(GND) IC2.P13(GND) IC2.R8(GND) IC2.R10(GND) IC2.R12(GND) IC2.R20(GND) IC2.T7(GND) IC2.T9(GND) IC2.T11(GND) IC2.T17(GND) IC2.U4(GND) IC2.U14(GND) IC2.V1(GND) IC2.V11(GND) IC2.V21(GND) IC2.W8(GND) IC2.W18(GND) IC2.Y5(GND) IC2.Y15(GND)
P1.2VTT: C173.1 C174.1 C175.1 C176.1 C177.1 IC2.B5(MGTAVTT) IC2.B7(MGTAVTT) IC2.B9(MGTAVTT) IC2.B11(MGTAVTT) IC2.C4(MGTAVTT) IC2.C8(MGTAVTT)
P1V0: C168.1 C169.1 C170.1 C171.1 C172.1 C178.1 C179.1 C180.1 C181.1 C182.1 C183.1 C184.1 C185.1 C186.1 IC2.D6(MGTAVCC) IC2.D10(MGTAVCC) IC2.E8(MGTAVCC) IC2.F7(MGTAVCC) IC2.F9(MGTAVCC) IC2.H8(VCCINT) IC2.H10(VCCINT) IC2.J7(VCCINT) IC2.J9(VCCINT) IC2.J11(VCCBRAM) IC2.K8(VCCINT) IC2.L7(VCCINT) IC2.L11(VCCBRAM) IC2.M8(VCCINT) IC2.N7(VCCINT) IC2.N11(VCCBRAM) IC2.P8(VCCINT) IC2.P10(VCCINT) IC2.R7(VCCINT) IC2.R9(VCCINT) IC2.T8(VCCINT) IC2.T10(VCCINT)
P1V5: C130.1 C131.1 C132.1 C133.1 C134.1 C135.1 C145.1 C146.1 C147.1 C148.1 C149.1 C150.1 C151.1 C187.1 IC2.AA7(VCCO_34) IC2.AB4(VCCO_34) IC2.C1(VCCO_35) IC2.F2(VCCO_35) IC2.H6(VCCO_35) IC2.J3(VCCO_35) IC2.M4(VCCO_35) IC2.N1(VCCO_35) IC2.R5(VCCO_34) IC2.T2(VCCO_34) IC2.V6(VCCO_34) IC2.W3(VCCO_34)
P1V8: C159.1 C160.1 C161.1 C162.1 C163.1 C164.1 C165.1 C166.1 C167.1 IC2.E12(VCCBATT_0) IC2.H12(VCCAUX) IC2.K10(VCCADC_0) IC2.K12(VCCAUX) IC2.M12(VCCAUX) IC2.P12(VCCAUX) IC2.R11(VCCAUX)
P3V3: C112.1 C113.1 C114.1 C115.1 C116.1 C117.1 C118.1 C119.1 C120.1 C121.1 C122.1 C123.1 C124.1 C125.1 C126.1 C127.1 C128.1 C129.1 C137.1 C138.1 C139.1 C140.1 C141.1 C142.1 C143.1 C144.1 IC2.A17(VCCO_16) IC2.AA17(VCCO_13) IC2.AB14(VCCO_13) IC2.B14(VCCO_16) IC2.C21(VCCO_16) IC2.D18(VCCO_16) IC2.E15(VCCO_16) IC2.F12(VCCO_0) IC2.F22(VCCO_16) IC2.M14(VCCO_14) IC2.P18(VCCO_14) IC2.R15(VCCO_14) IC2.T12(VCCO_0) IC2.T22(VCCO_14) IC2.U19(VCCO_14) IC2.V16(VCCO_13) IC2.W13(VCCO_13) IC2.Y10(VCCO_13) IC2.Y20(VCCO_14)
VCC_BANK15: C152.1 C153.1 C154.1 C155.1 C157.1 C158.1 C188.1 IC2.G19(VCCO_15) IC2.H16(VCCO_15) IC2.J13(VCCO_15) IC2.K20(VCCO_15) IC2.L17(VCCO_15) IC2.N21(VCCO_15)

Not connected (* = marked no-connect by the designer): IC2 AA9(NC) AA10(NC) AA11(NC) AA13(NC) AA14(NC) AA15(NC) AA16(NC) AB10(NC) AB11(NC) AB12(NC) AB13(NC) AB15(NC) AB16(NC) AB17(NC) T14(NC) T15(NC) T16(NC) U15(NC) U16(NC) V10(NC) V13(NC) V14(NC) V15(NC) W10(NC) W11(NC) W12(NC) W14(NC) W15(NC) W16(NC) Y11(NC) Y12(NC) Y13(NC) Y14(NC) Y16(NC) Y17(NC)

### Notes on the sheet
- connect extra bank 13 to VCCO_13 improve ESD
- This design is derived from NETV2 project
  https://github.com/AlphamaxMedia/netv2-mainboard
  Parts of schematics and routing were used.
- Project/Equipment
- Document
- Designer
- Drawn by
- Check.by
- Copyright WUT ISE 2019.
  This documentation describes Open Hardware and is licensed under the CERN OHL v.1.1. You may redistribute and modify this documentation under the terms of the CERN OHL v.1.1. (http://ohwr.org/CERNOHL). This documentation is distributed WITHOUT ANY EXPRESS OR IMPLIED WARRANTY, INCLUDING OF MERCHANTABILITY, SATISFACTORY QUALITY AND FITNESS FOR A PARTICULAR PURPOSE. Please see the CERN OHL v.1.1 for applicable conditions.
- Contact
- File
- Last Mod.
- Print Date
- Sheet
- Size
- A3
- of
- Rev

### Library data of the parts
C112 C167 C186 = CC1206_100UF_6.3V_20%_X5R: Non-polarised capacitor; Part Description: SMD Multilayer Chip Ceramic Capacitor; Manufacturer: GENERIC; Manufacturer1 Part Number: C1206C107M9PACTU; Voltage: 6.3V; TC: X5R; Tolerance: ±10%; Part Number: CC1206_100UF_6.3V_20%_X5R; Component Kind: Standard; Component Type: Standard; Pin Count: 2; Value: 100uF; Status: None; Manufacturer Part Number: CC1206_100UF_6.3V_20%_X5R; Case: 1206; Mounted: Yes; Socket: No; SMD: Yes; Sense: No; Manufacturer1 Example: KEMET; Manufacturer1 ComponentHeight: 1.8mm; HelpURL: \\cern.ch\dfs\Applications\Altium\Datasheets\CC1206_X5R_KEMET.pdf; Author: CERN DEM JLC; CreateDate: 26.09.2012; LatestRevisionDate: 26.09.2012
C113-C117 C121-C133 C137-C140 C144-C148 C152-C155 C159 C162-C166 C172 C178-C182 = CC0201_470NF_4V_20%_X5R: Non-polarised capacitor; Part Description: SMD Multilayer Chip Ceramic Capacitor; Manufacturer: GENERIC; Manufacturer1 Part Number: AMK063BJ474MP-F; Voltage: 4V; TC: X5R; Tolerance: ±20%; Part Number: CC0201_470NF_4V_20%_X5R; Component Kind: Standard; Component Type: Standard; Pin Count: 2; Value: 470nF; Status: Not Recommended; Manufacturer Part Number: CC0201_470NF_4V_20%_X5R; Case: 0201; Mounted: Yes; Socket: No; SMD: Yes; Sense: No; Manufacturer1 Example: TAIYO YUDEN; Manufacturer1 ComponentHeight: 0.33mm; HelpURL: \\cern.ch\dfs\Applications\Altium\Datasheets\CC0201_X5R_TAIYO-YUDEN_STANDARD-CLASS2.pdf; Author: CERN DEM JLC; CreateDate: 27.05.2010; LatestRevisionDate: 27.05.2010
C118-C120 C134 C135 C141-C143 C149-C151 C157 C158 C160 C161 C168 C171 C177 C183-C185 C187 C188 = CC0402_4.7UF_6.3V_20%_X5R: as C8 on sheet Ethernet_SD; Part Number: CC0402_4.7UF_6.3V_20%_X5R; Component Kind: Standard; Component Type: Standard; Pin Count: 2; Value: 4.7uF; Status: Preferred; Manufacturer Part Number: CC0402_4.7UF_6.3V_20%_X5R; Case: 0402; Mounted: Yes; Socket: No; SMD: Yes; Sense: No; Manufacturer1 Example: TDK; Manufacturer1 ComponentHeight: 0.65mm; HelpURL: \\cern.ch\dfs\Applications\Altium\Datasheets\CC0402_X5R_TDK_C.pdf; Author: CERN DEM JLC; CreateDate: 03.03.2015; LatestRevisionDate: 03.03.2015
C169 C170 C173-C176 = CC0201_100NF_6.3V_10%_X5R: as C105-C107 on sheet GPS_SATA; Part Number: CC0201_100NF_6.3V_10%_X5R; Component Kind: Standard; Component Type: Standard; Pin Count: 2; Value: 100nF; Status: Not Recommended; Manufacturer Part Number: CC0201_100NF_6.3V_10%_X5R; Case: 0201; Mounted: Yes; Socket: No; SMD: Yes; Sense: No; Manufacturer1 Example: AVX; Manufacturer1 ComponentHeight: 0.33mm; HelpURL: \\cern.ch\dfs\Applications\Altium\Datasheets\CC0201_X5R_AVX.pdf; Author: CERN DEM JLC; CreateDate: 03.12.2007; LatestRevisionDate: 03.12.2007
IC2 = XC7A50T-2FGG484C: Artix-7 FPGA, 4 GTPs, 250 User I/Os, 484-Ball Fine-Pitch Thin BGA (1.0mm Pitch), Speed Grade 2, Commercial Grade, Pb-Free; Manufacturer: XILINX; PressFit: No; Bonding: No; Part Number: XC7A50T-2FGG484C; Component Kind: Standard; Component Type: Standard; Device: XC7A50T-2FGG484C; PackageDescription: BGA, 1.00mm Pitch, Square; 484 Pin, 22 Columns x 22 Rows, Body 23mm X 23mm X 2.60mm H, IPC Medium Density; Part Description: Artix-7 FPGA, 4 GTPs, 250 User I/Os, 484-Ball Fine-Pitch Thin BGA (1.0mm Pitch), Speed Grade 2, Commercial Grade, Pb-Free; Manufacturer Part Number: XC7A50T-2FGG484C; Pin Count: 484; Case: BGA484; Mounted: Yes; Socket: No; SMD: Yes; Sense: No; ComponentHeight: 2.6mm; HelpURL: \\cern.ch\dfs\Applications\Altium\Datasheets\XC7A50T-2FGG484C.pdf; ComponentLink1URL: \\cern.ch\dfs\Applications\Altium\Datasheets\XC7A50T-2FGG484C_Package-Pinout.pdf; ComponentLink1Description: Package/Pinout; Author: CERN DEM JMW; CreateDate: 26.07.2018; LatestRevisionDate: 26.07.2018

## Nets that join several sheets
GND: Power_Supply (97 pins), FPGA_config (21 pins), FPGA (7 pins), DDR3_Memory (85 pins), GPS_SATA (50 pins), Ethernet_SD (32 pins), FPGA_Supply (167 pins)
P1.2VTT: Power_Supply (C27.1 IC14.A2 TP15.1), FPGA (R53.2), FPGA_Supply (11 pins)
P1V0: Power_Supply (9 pins), FPGA_Supply (36 pins)
P1V5: Power_Supply (7 pins), DDR3_Memory (60 pins), FPGA_Supply (26 pins)
P1V8: Power_Supply (7 pins), GPS_SATA (J12.2 J12.4 J12.6), FPGA_Supply (16 pins)
P3V3: Power_Supply (15 pins), FPGA_config (14 pins), FPGA (C52.1 OSC10.1 OSC10.4), GPS_SATA (7 pins), Ethernet_SD (17 pins), FPGA_Supply (45 pins)
P5V0: Power_Supply (17 pins), FPGA_config (MOD10.2 MOD10.4)
VCC_BANK15: GPS_SATA (J12.25 J12.26 J12.31 J12.32), FPGA_Supply (13 pins)
VTT: Power_Supply (C37.1 IC16.3 IC16.5), DDR3_Memory (34 pins)
VTT_REF: Power_Supply (C39.1 IC16.6), FPGA (8 pins), DDR3_Memory (10 pins)
AT_EVENT: Power_Supply (IC23.4 R41.1), FPGA (IC2.U21)
DDR3_A0: FPGA (IC2.U6), DDR3_Memory (IC20.N3 IC21.N3 RN13.5)
DDR3_A1: FPGA (IC2.V4), DDR3_Memory (IC20.P7 IC21.P7 RN13.7)
DDR3_A2: FPGA (IC2.W5), DDR3_Memory (IC20.P3 IC21.P3 RN13.8)
DDR3_A3: FPGA (IC2.V5), DDR3_Memory (IC20.N2 IC21.N2 RN12.7)
DDR3_A4: FPGA (IC2.AA1), DDR3_Memory (IC20.P8 IC21.P8 RN11.6)
DDR3_A5: FPGA (IC2.Y2), DDR3_Memory (IC20.P2 IC21.P2 RN10.7)
DDR3_A6: FPGA (IC2.AB1), DDR3_Memory (IC20.R8 IC21.R8 RN11.8)
DDR3_A7: FPGA (IC2.AB3), DDR3_Memory (IC20.R2 IC21.R2 RN10.6)
DDR3_A8: FPGA (IC2.AB2), DDR3_Memory (IC20.T8 IC21.T8 RN10.5)
DDR3_A9: FPGA (IC2.Y3), DDR3_Memory (IC20.R3 IC21.R3 RN10.8)
DDR3_A10: FPGA (IC2.W6), DDR3_Memory (IC20.L7 IC21.L7 RN15.8)
DDR3_A11: FPGA (IC2.Y1), DDR3_Memory (IC20.R7 IC21.R7 RN12.5)
DDR3_A12: FPGA (IC2.V2), DDR3_Memory (IC20.N7 IC21.N7 RN12.6)
DDR3_A13: FPGA (IC2.AA3), DDR3_Memory (IC20.T3 IC21.T3 RN11.7)
DDR3_BA0: FPGA (IC2.U5), DDR3_Memory (IC20.M2 IC21.M2 RN12.8)
DDR3_BA1: FPGA (IC2.W4), DDR3_Memory (IC20.N8 IC21.N8 RN13.6)
DDR3_BA2: FPGA (IC2.V7), DDR3_Memory (IC20.M3 IC21.M3 RN14.6)
DDR3_CAS_N: FPGA (IC2.Y7), DDR3_Memory (IC20.K3 IC21.K3 RN15.6)
DDR3_CK_N: FPGA (IC2.R2), DDR3_Memory (C78.1 IC20.K7 IC21.K7 R58.1)
DDR3_CK_P: FPGA (IC2.R3), DDR3_Memory (C78.2 IC20.J7 IC21.J7 R57.1)
DDR3_CKE: FPGA (IC2.Y8), DDR3_Memory (IC20.K9 IC21.K9 RN15.7)
DDR3_CS0_N: FPGA (IC2.V9), DDR3_Memory (IC20.L2 IC21.L2 RN15.5)
DDR3_DM0: FPGA (IC2.G1), DDR3_Memory (IC21.E7)
DDR3_DM1: FPGA (IC2.H4), DDR3_Memory (IC21.D3)
DDR3_DM2: FPGA (IC2.M5), DDR3_Memory (IC20.E7)
DDR3_DM3: FPGA (IC2.L3), DDR3_Memory (IC20.D3)
DDR3_DQ0: FPGA (IC2.C2), DDR3_Memory (IC21.E3)
DDR3_DQ1: FPGA (IC2.F1), DDR3_Memory (IC21.F7)
DDR3_DQ2: FPGA (IC2.B1), DDR3_Memory (IC21.F2)
DDR3_DQ3: FPGA (IC2.F3), DDR3_Memory (IC21.F8)
DDR3_DQ4: FPGA (IC2.A1), DDR3_Memory (IC21.H3)
DDR3_DQ5: FPGA (IC2.D2), DDR3_Memory (IC21.H8)
DDR3_DQ6: FPGA (IC2.B2), DDR3_Memory (IC21.G2)
DDR3_DQ7: FPGA (IC2.E2), DDR3_Memory (IC21.H7)
DDR3_DQ8: FPGA (IC2.J5), DDR3_Memory (IC21.D7)
DDR3_DQ9: FPGA (IC2.H3), DDR3_Memory (IC21.C3)
DDR3_DQ10: FPGA (IC2.K1), DDR3_Memory (IC21.C8)
DDR3_DQ11: FPGA (IC2.H2), DDR3_Memory (IC21.C2)
DDR3_DQ12: FPGA (IC2.J1), DDR3_Memory (IC21.A7)
DDR3_DQ13: FPGA (IC2.G2), DDR3_Memory (IC21.A2)
DDR3_DQ14: FPGA (IC2.H5), DDR3_Memory (IC21.B8)
DDR3_DQ15: FPGA (IC2.G3), DDR3_Memory (IC21.A3)
DDR3_DQ16: FPGA (IC2.N2), DDR3_Memory (IC20.E3)
DDR3_DQ17: FPGA (IC2.M6), DDR3_Memory (IC20.F7)
DDR3_DQ18: FPGA (IC2.P1), DDR3_Memory (IC20.F2)
DDR3_DQ19: FPGA (IC2.N5), DDR3_Memory (IC20.F8)
DDR3_DQ20: FPGA (IC2.P2), DDR3_Memory (IC20.H3)
DDR3_DQ21: FPGA (IC2.N4), DDR3_Memory (IC20.H8)
DDR3_DQ22: FPGA (IC2.R1), DDR3_Memory (IC20.G2)
DDR3_DQ23: FPGA (IC2.P6), DDR3_Memory (IC20.H7)
DDR3_DQ24: FPGA (IC2.K3), DDR3_Memory (IC20.D7)
DDR3_DQ25: FPGA (IC2.M2), DDR3_Memory (IC20.C3)
DDR3_DQ26: FPGA (IC2.K4), DDR3_Memory (IC20.C8)
DDR3_DQ27: FPGA (IC2.M3), DDR3_Memory (IC20.C2)
DDR3_DQ28: FPGA (IC2.J6), DDR3_Memory (IC20.A7)
DDR3_DQ29: FPGA (IC2.L5), DDR3_Memory (IC20.A2)
DDR3_DQ30: FPGA (IC2.J4), DDR3_Memory (IC20.B8)
DDR3_DQ31: FPGA (IC2.K6), DDR3_Memory (IC20.A3)
DDR3_DQS0_N: FPGA (IC2.D1), DDR3_Memory (IC21.G3)
DDR3_DQS0_P: FPGA (IC2.E1), DDR3_Memory (IC21.F3)
DDR3_DQS1_N: FPGA (IC2.J2), DDR3_Memory (IC21.B7)
DDR3_DQS1_P: FPGA (IC2.K2), DDR3_Memory (IC21.C7)
DDR3_DQS2_N: FPGA (IC2.P4), DDR3_Memory (IC20.G3)
DDR3_DQS2_P: FPGA (IC2.P5), DDR3_Memory (IC20.F3)
DDR3_DQS3_N: FPGA (IC2.L1), DDR3_Memory (IC20.B7)
DDR3_DQS3_P: FPGA (IC2.M1), DDR3_Memory (IC20.C7)
DDR3_ODT0: FPGA (IC2.W9), DDR3_Memory (IC20.K1 IC21.K1 RN14.7)
DDR3_RAS_N: FPGA (IC2.Y9), DDR3_Memory (IC20.J3 IC21.J3 RN14.8)
DDR3_RESET_N: FPGA (IC2.AB5), DDR3_Memory (IC20.T2 IC21.T2 R54.2)
DDR3_WE_N: FPGA (IC2.V8), DDR3_Memory (IC20.L3 IC21.L3 RN14.5)
ETH_50MHZ: FPGA (IC2.D17), Ethernet_SD (IC1.8)
ETH_CRS_DV: FPGA (IC2.C20), Ethernet_SD (IC1.15 R8.2)
ETH_INTRP: FPGA (IC2.D21), Ethernet_SD (IC1.18 R2.1)
ETH_MDC: FPGA (IC2.F14), Ethernet_SD (IC1.11)
ETH_MDIO: FPGA (IC2.F13), Ethernet_SD (IC1.10 R1.1)
ETH_RST: FPGA (IC2.F16), Ethernet_SD (C7.1 D1.2 IC1.24 R7.2)
ETH_RXD0: FPGA (IC2.A20), Ethernet_SD (IC1.13)
ETH_RXD1: FPGA (IC2.B18), Ethernet_SD (IC1.12)
ETH_RXER: FPGA (IC2.B20), Ethernet_SD (IC1.17)
ETH_TXD0: FPGA (IC2.C18), Ethernet_SD (IC1.20)
ETH_TXD1: FPGA (IC2.C19), Ethernet_SD (IC1.21)
ETH_TXEN: FPGA (IC2.A19), Ethernet_SD (IC1.19)
FPGA_LED0: FPGA (IC2.B15), Ethernet_SD (R9.2)
FPGA_LED1: FPGA (IC2.A13), Ethernet_SD (R61.2)
FPGA_LED2: FPGA (IC2.B16), Ethernet_SD (R65.2)
FPGA_LED3: FPGA (IC2.A16), Ethernet_SD (R66.2)
FPGA_LED4: FPGA (IC2.A15), Ethernet_SD (R63.2)
FPGA_LED5: FPGA (IC2.B13), Ethernet_SD (R62.2)
FPGA_SPI_CS: FPGA_config (IC19.1 R47.2), FPGA (IC2.T19)
FPGA_SPI_MISO_D1: FPGA_config (IC19.2), FPGA (IC2.R22)
FPGA_SPI_MOSI_D0: FPGA_config (IC19.5), FPGA (IC2.P22)
FPGA_SPI_RES_D3: FPGA_config (IC19.7 R49.2), FPGA (IC2.R21)
FPGA_SPI_WP_D2: FPGA_config (IC19.3 R50.2), FPGA (IC2.P21)
GPS_EXTINT: FPGA (IC2.V19), GPS_SATA (L20.2)
GPS_RSTn: FPGA (IC2.U17), GPS_SATA (L17.1)
GPS_RxD: FPGA (IC2.V20), GPS_SATA (L22.2)
GPS_SAFEBOOTn: FPGA (IC2.Y19), GPS_SATA (L23.2)
GPS_TxD: FPGA (IC2.U20), GPS_SATA (L25.1)
MCU_INT0: FPGA_config (MOD10.3), FPGA (IC2.D15)
MCU_INT1: FPGA_config (MOD10.5), FPGA (IC2.E16)
MGT_Rx0_N: FPGA (IC2.A8), GPS_SATA (J13.5)
MGT_Rx0_P: FPGA (IC2.B8), GPS_SATA (J13.6)
MGT_Rx1_N: FPGA (IC2.C11), GPS_SATA (J14.5)
MGT_Rx1_P: FPGA (IC2.D11), GPS_SATA (J14.6)
MGT_Rx2_N: FPGA (IC2.A10), GPS_SATA (J15.5)
MGT_Rx2_P: FPGA (IC2.B10), GPS_SATA (J15.6)
MGT_Rx3_N: FPGA (IC2.C9), GPS_SATA (J17.5)
MGT_Rx3_P: FPGA (IC2.D9), GPS_SATA (J17.6)
MGT_Tx0_N: FPGA (C55.1), GPS_SATA (J13.3)
MGT_Tx0_P: FPGA (C54.1), GPS_SATA (J13.2)
MGT_Tx1_N: FPGA (C58.1), GPS_SATA (J14.3)
MGT_Tx1_P: FPGA (C57.1), GPS_SATA (J14.2)
MGT_Tx2_N: FPGA (C60.1), GPS_SATA (J15.3)
MGT_Tx2_P: FPGA (C59.1), GPS_SATA (J15.2)
MGT_Tx3_N: FPGA (C62.1), GPS_SATA (J17.3)
MGT_Tx3_P: FPGA (C61.1), GPS_SATA (J17.2)
PGOOD_LED: Power_Supply (5 pins), Ethernet_SD (T1.1)
POE_VC+: Power_Supply (C156.2 D11.1 L15.1 R140.2), Ethernet_SD (D2.1 D3.1 D4.1 D5.1)
POE_VC-: Power_Supply (6 pins), Ethernet_SD (D6.2 D7.2 D8.2 D9.2)
REFCLK_N: FPGA (C56.2), GPS_SATA (C106.2)
REFCLK_P: FPGA (C53.2), GPS_SATA (C105.2)
RPI_SPI_CE0: FPGA_config (MOD10.24), FPGA (IC2.Y22)
RPI_SPI_CE1: FPGA_config (MOD10.26), FPGA (IC2.Y21)
RPI_SPI_MISO: FPGA_config (MOD10.21), FPGA (IC2.W21)
RPI_SPI_MOSI: FPGA_config (MOD10.19), FPGA (IC2.W22)
RPI_SPI_SCLK: FPGA_config (MOD10.23), FPGA (IC2.V22)
SD_CLK: FPGA (IC2.AB22), Ethernet_SD (J2.5)
SD_CMD: FPGA (IC2.AA19), Ethernet_SD (J2.3 R64.2)
SD_DAT0: FPGA (IC2.AA20), Ethernet_SD (J2.7)
SD_DAT1: FPGA (IC2.AA21), Ethernet_SD (J2.8)
SD_DAT2: FPGA (IC2.AB21), Ethernet_SD (J2.1)
SD_DAT3: FPGA (IC2.AB20), Ethernet_SD (J2.2)
TIMEPULSE: FPGA (IC2.Y18), GPS_SATA (L21.2)
UART0_RX: FPGA_config (MOD10.8 P11.2), FPGA (IC2.E13)
UART0_TX: FPGA_config (MOD10.10 P11.3), FPGA (IC2.E14)
USR_LVDS1_N: FPGA (IC2.G13), GPS_SATA (J12.10)
USR_LVDS1_P: FPGA (IC2.H13), GPS_SATA (J12.12)
USR_LVDS2_N: FPGA (IC2.G16), GPS_SATA (J12.9)
USR_LVDS2_P: FPGA (IC2.G15), GPS_SATA (J12.11)
USR_LVDS3_N: FPGA (IC2.H14), GPS_SATA (J12.16)
USR_LVDS3_P: FPGA (IC2.J14), GPS_SATA (J12.18)
USR_LVDS4_N: FPGA (IC2.G18), GPS_SATA (J12.15)
USR_LVDS4_P: FPGA (IC2.G17), GPS_SATA (J12.17)
USR_LVDS5_N: FPGA (IC2.H15), GPS_SATA (J12.22)
USR_LVDS5_P: FPGA (IC2.J15), GPS_SATA (J12.24)
USR_LVDS6_N: FPGA (IC2.H18), GPS_SATA (J12.21)
USR_LVDS6_P: FPGA (IC2.H17), GPS_SATA (J12.23)
USR_LVDS7_N: FPGA (IC2.H22), GPS_SATA (J12.28)
USR_LVDS7_P: FPGA (IC2.J22), GPS_SATA (J12.30)
USR_LVDS8_N: FPGA (IC2.G20), GPS_SATA (J12.27)
USR_LVDS8_P: FPGA (IC2.H20), GPS_SATA (J12.29)
USR_LVDS9_N: FPGA (IC2.K22), GPS_SATA (J12.34)
USR_LVDS9_P: FPGA (IC2.K21), GPS_SATA (J12.36)
USR_LVDS10_N: FPGA (IC2.L21), GPS_SATA (J12.33)
USR_LVDS10_P: FPGA (IC2.M21), GPS_SATA (J12.35)
USR_LVDS11CC_N: FPGA (IC2.J21), GPS_SATA (J12.40)
USR_LVDS11CC_P: FPGA (IC2.J20), GPS_SATA (J12.42)
USR_LVDS12CC_N: FPGA (IC2.H19), GPS_SATA (J12.39)
USR_LVDS12CC_P: FPGA (IC2.J19), GPS_SATA (J12.41)
USR_LVDS13CC_N: FPGA (IC2.K19), GPS_SATA (J12.46)
USR_LVDS13CC_P: FPGA (IC2.K18), GPS_SATA (J12.48)
USR_LVDS14CC_N: FPGA (IC2.L20), GPS_SATA (J12.45)
USR_LVDS14CC_P: FPGA (IC2.L19), GPS_SATA (J12.47)
USR_LVDS15_N: FPGA (IC2.M22), GPS_SATA (J12.52)
USR_LVDS15_P: FPGA (IC2.N22), GPS_SATA (J12.54)
USR_LVDS16_N: FPGA (IC2.L18), GPS_SATA (J12.51)
USR_LVDS16_P: FPGA (IC2.M18), GPS_SATA (J12.53)
USR_LVDS17_N: FPGA (IC2.N19), GPS_SATA (J12.58)
USR_LVDS17_P: FPGA (IC2.N18), GPS_SATA (J12.60)
USR_LVDS18_N: FPGA (IC2.M20), GPS_SATA (J12.57)
USR_LVDS18_P: FPGA (IC2.N20), GPS_SATA (J12.59)
USR_LVDS19_N: FPGA (IC2.K14), GPS_SATA (J12.64)
USR_LVDS19_P: FPGA (IC2.K13), GPS_SATA (J12.66)
USR_LVDS20_N: FPGA (IC2.L13), GPS_SATA (J12.63)
USR_LVDS20_P: FPGA (IC2.M13), GPS_SATA (J12.65)
USR_LVDS21_N: FPGA (IC2.J17), GPS_SATA (J12.70)
USR_LVDS21_P: FPGA (IC2.K17), GPS_SATA (J12.72)
USR_LVDS22_N: FPGA (IC2.L15), GPS_SATA (J12.69)
USR_LVDS22_P: FPGA (IC2.L14), GPS_SATA (J12.71)
USR_LVDS23_N: FPGA (IC2.K16), GPS_SATA (J12.76)
USR_LVDS23_P: FPGA (IC2.L16), GPS_SATA (J12.78)
USR_LVDS24_N: FPGA (IC2.M16), GPS_SATA (J12.75)
USR_LVDS24_P: FPGA (IC2.M15), GPS_SATA (J12.77)